# Altium project CABINET_IOT-V1.PrjPcb (part 1 of 2)
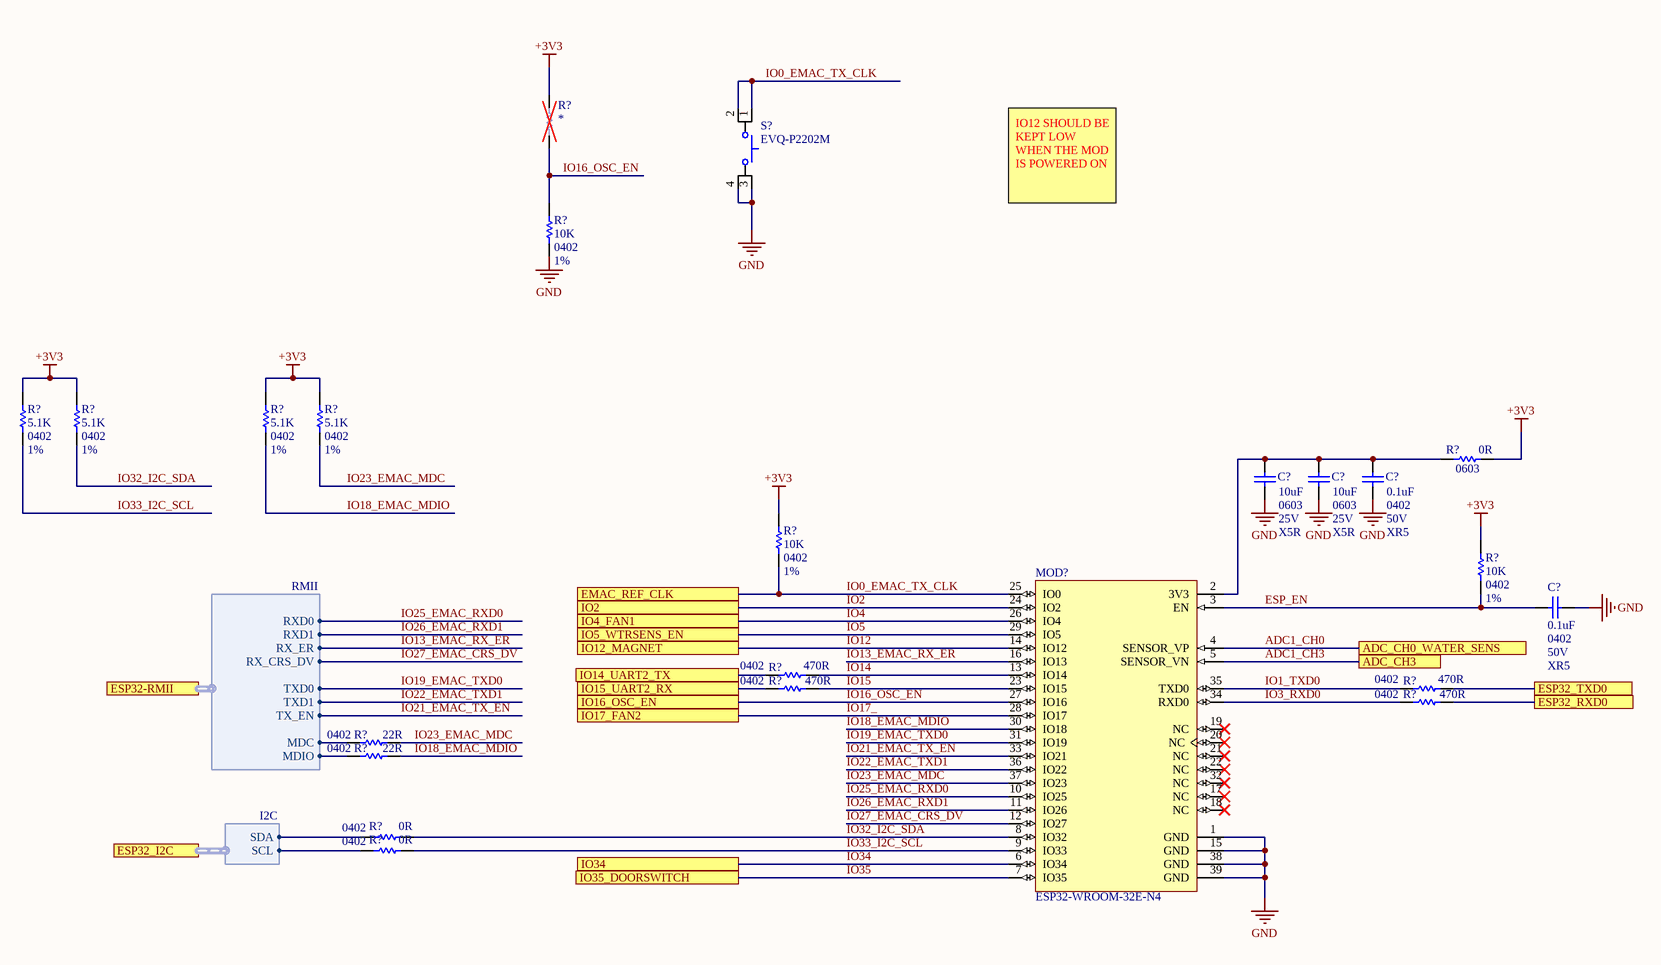
[diagram p0: 000_MCU - ESP32.SchDoc]
GlobalDrawnBy: J-E.Pachon-J.Jaramillo; GlobalReleaseDate: 202610xx; GlobalRevision: 1; GlobalVersion: 1
7 sheets, 185 parts. Net scope: flat (ports and power ports of the same name join across sheets).
Board file: Main-CABINET_IOT-V1.PcbDoc
Sheets:
  Main.SchDoc
  000_MCU - ESP32.SchDoc
  100_Power Supply.SchDoc
  200_Ethernet.SchDoc
  300_Control.SchDoc
  400_Sensors.SchDoc
  500_External.SchDoc

## Sheet Main.SchDoc: Main
size A4; Date: 202610xx; DrawnBy: J-E.Pachon-J.Jaramillo; Revision: V1R1; SheetNumber: 1; SheetTotal: 7

### Notes on the sheet
- Title:
- Project:
- File:
- Revision:
- Date:
- Size:
- A4
- Drawn by:
- www.somosinternet.com <http://www.somosinternet.com>

## Sheet 000_MCU - ESP32.SchDoc: MCU-ESP32
size A3; Date: 202610xx; DrawnBy: J-E.Pachon-J.Jaramillo; Revision: V1R1; SheetNumber: 2; SheetTotal: 7

### Parts
(Parts that share a designator on the sheet are numbered #1, #2 ... from top to bottom, then left to right.)
C?#1  10uF  PackageReference: 0603  Voltage: 25V  Temperature Coeficient: X5R  [CAPC1608X05N[0603]]
C?#2  10uF  PackageReference: 0603  Voltage: 25V  Temperature Coeficient: X5R  [CAPC1608X05N[0603]]
C?#3  0.1uF  PackageReference: 0402  Voltage: 50V  Temperature Coeficient: XR5  [CAPC1005X03N[0402]]
C?#4  0.1uF  PackageReference: 0402  Voltage: 50V  Temperature Coeficient: XR5  [CAPC1005X03N[0402]]
MOD?  ESP32-WROOM-32E-N4  [ESP32-WROOM-32D]
R?#1  *  [RESC1005X03N[0402]]
R?#2  10K  PackageReference: 0402  Tolerance: 1%  [RESC1005X03N[0402]]
R?#3  5.1K  PackageReference: 0402  Tolerance: 1%  [RESC1005X03N[0402]]
R?#4  5.1K  PackageReference: 0402  Tolerance: 1%  [RESC1005X03N[0402]]
R?#5  5.1K  PackageReference: 0402  Tolerance: 1%  [RESC1005X03N[0402]]
R?#6  5.1K  PackageReference: 0402  Tolerance: 1%  [RESC1005X03N[0402]]
R?#7  0R  PackageReference: 0603  [RESC1608X05N[0603]]
R?#8  10K  PackageReference: 0402  Tolerance: 1%  [RESC1005X03N[0402]]
R?#9  10K  PackageReference: 0402  Tolerance: 1%  [RESC1005X03N[0402]]
R?#10  470R  PackageReference: 0402  [RESC1005X03N[0402]]
R?#11  470R  PackageReference: 0402  [RESC1005X03N[0402]]
R?#12  470R  PackageReference: 0402  [RESC1005X03N[0402]]
R?#13  470R  PackageReference: 0402  [RESC1005X03N[0402]]
R?#14  22R  PackageReference: 0402  [RESC1005X03N[0402]]
R?#15  22R  PackageReference: 0402  [RESC1005X03N[0402]]
R?#16  0R  PackageReference: 0402  [RESC1005X03N[0402]]
R?#17  0R  PackageReference: 0402  [RESC1005X03N[0402]]
S?  EVQ-P2202M  [BTN470X350X210-4N]

### Ports
ADC_CH0_WATER_SENS, ADC_CH3, EMAC_REF_CLK, ESP32-RMII (harness RMII), ESP32_I2C (harness I2C), ESP32_RXD0, ESP32_TXD0, IO2, IO4_FAN1, IO5_WTRSENS_EN, IO12_MAGNET, IO14_UART2_TX, IO15_UART2_RX, IO16_OSC_EN, IO17_FAN2, IO34, IO35_DOORSWITCH

### Harnesses
RMII: TXD0, TXD1, TX_EN, MDC, MDIO, RXD0, RXD1, RX_ER, RX_CRS_DV
I2C: SDA, SCL

### Nets
+3V3: R?#1.2 R?#3.1 R?#4.1 R?#5.1 R?#6.1 R?#7.2 R?#8.2 R?#9.2  [project net MDIO_LAN]
GND: C?#1.1 C?#2.1 C?#3.1 C?#4.2 MOD?.1(GND) MOD?.15(GND) MOD?.38(GND) MOD?.39(GND) R?#2.1 S?.3 S?.4  [project net +12V]
ADC1_CH0: MOD?.4(SENSOR_VP) ; port ADC_CH0_WATER_SENS
ADC1_CH3: MOD?.5(SENSOR_VN) ; port ADC_CH3
ESP_EN: C?#4.1 MOD?.3(EN) R?#9.1
IO0_EMAC_TX_CLK: MOD?.25(IO0) R?#8.1 S?.1 S?.2 ; port EMAC_REF_CLK  [project net EMAC_REF_CLK]
IO1_TXD0: MOD?.35(TXD0) R?#12.2
IO2: MOD?.24(IO2) ; port IO2
IO3_RXD0: MOD?.34(RXD0) R?#13.2
IO4: MOD?.26(IO4) ; port IO4_FAN1  [project net FAN_CTRL1]
IO5: MOD?.29(IO5) ; port IO5_WTRSENS_EN
IO12: MOD?.14(IO12) ; port IO12_MAGNET  [project net FAN_CTRL3]
IO13_EMAC_RX_ER: MOD?.16(IO13) ; port ESP32-RMII.RX_ER
IO14: MOD?.13(IO14) R?#10.1
IO15: MOD?.23(IO15) R?#11.1
IO16_OSC_EN: MOD?.27(IO16) R?#1.1 R?#2.2 ; port IO16_OSC_EN
IO17_: MOD?.28(IO17) ; port IO17_FAN2  [project net FAN_CTRL2]
IO18_EMAC_MDIO: MOD?.30(IO18) R?#5.2 R?#15.2
IO19_EMAC_TXD0: MOD?.31(IO19) ; port ESP32-RMII.TXD0
IO21_EMAC_TX_EN: MOD?.33(IO21) ; port ESP32-RMII.TX_EN
IO22_EMAC_TXD1: MOD?.36(IO22) ; port ESP32-RMII.TXD1
IO23_EMAC_MDC: MOD?.37(IO23) R?#6.2 R?#14.2
IO25_EMAC_RXD0: MOD?.10(IO25) ; port ESP32-RMII.RXD0
IO26_EMAC_RXD1: MOD?.11(IO26) ; port ESP32-RMII.RXD1
IO27_EMAC_CRS_DV: MOD?.12(IO27) ; port ESP32-RMII.RX_CRS_DV
IO32_I2C_SDA: MOD?.8(IO32) R?#4.2 R?#16.1
IO33_I2C_SCL: MOD?.9(IO33) R?#3.2 R?#17.1
IO34: MOD?.6(IO34) ; port IO34
IO35: MOD?.7(IO35) ; port IO35_DOORSWITCH
NetC?#1_2: C?#1.2 C?#2.2 C?#3.2 MOD?.2(3V3) R?#7.1
NetR?#10_2: R?#10.2 ; port IO14_UART2_TX
NetR?#11_2: R?#11.2 ; port IO15_UART2_RX
NetR?#12_1: R?#12.1 ; port ESP32_TXD0
NetR?#13_1: R?#13.1 ; port ESP32_RXD0
NetR?#14_1: R?#14.1 ; port ESP32-RMII.MDC
NetR?#15_1: R?#15.1 ; port ESP32-RMII.MDIO
NetR?#16_2: R?#16.2 ; port ESP32_I2C.SDA
NetR?#17_2: R?#17.2 ; port ESP32_I2C.SCL

Not connected (* = marked no-connect by the designer): MOD? 17(NC)* 18(NC)* 19(NC)* 20(NC)* 21(NC)* 22(NC)* 32(NC)*

### Notes on the sheet
- IO12 SHOULD BE KEPT LOW WHEN THE MOD IS POWERED ON
- Title:
- Project:
- File:
- Revision:
- Date:
- Size:
- A3
- Drawn by:
- www.somosinternet.com <http://www.somosinternet.com>

### Library data of the parts
C?#1-C?#4 = CAP-generic: Chip Ceramic Capacitor SMD; Populated: Yes; Manuf1: *; Manuf2: *; Manuf1Partnumber: *; Manuf2Partnumber: *; ClassName: *; ROHS: Yes; LifeCycle: Checked; HelpURL: *
  C?#1 C?#2: Value: 10uF; Supplier 1: DigiKey; Supplier Part Number 1: 1276-1869-1-ND
  C?#3 C?#4: Value: 0.1uF; LCSC: C2888326; ComponentLink1Description: LCSC Link; ComponentLink1URL: https://www.lcsc.com/product-detail/C2888326.html?s_z=n_q_t_0.1uF%25200402&spm=wm.fly.bg.1.xh___wm.ssy.tc.0.tz&lcsc_vid=EgJfAwZfQFAKX11URFdeUQJWEVdaBVZUTgRWV10EQ1MxVlNeRFBaUFRXTlVaVDsOAxUeFF5JWBYZEEoKFBINSQcJGk4NBhADEA4cHktXRlVcSQwSGg0%3D
MOD? = ESP32-WROOM-32E-N4: RF TXRX MOD BT WIFI TH SMD; Manufacturer: Espressif Systems; Manufacturer Part Number: ESP32-WROOM-32E-N4; ComponentLink1URL: https://www.lcsc.com/product-detail/C701341.html?s_z=n_q_%2509%2520ESP32-WROOM-32E; ComponentLink1Description: LCSC; Supplier Part Number: C701341; Supplier: LCSC
R?#1 = DNP-RES: (DNP) "Do Not Populate" Chip Resistor SMD; Populated: No; Value: *; Manuf1: *; Manuf2: *; Manuf1Partnumber: *; Manuf2Partnumber: *; ClassName: *; ROHS: Yes; LifeCycle: Checked; HelpURL: *; Power: *; Tolerance: *
R?#2-R?#9 R?#14 R?#15 = RES-generic: Chip Resistor SMD; Populated: Yes; Manuf1: *; Manuf2: *; Manuf1Partnumber: *; Manuf2Partnumber: *; ClassName: *; ROHS: Yes; LifeCycle: Checked; HelpURL: *; Power: *
  R?#2 R?#8 R?#9: Value: 10K; Supplier 1: DigiKey; Supplier Part Number 1: 311-0.0JRCT-ND; ComponentLink1Description: LCSC Link; ComponentLink1URL: https://www.lcsc.com/product-detail/C2906861.html?s_z=n_q_t_10k%25200402&spm=wm.fly.bg.1.xh___wm.ssy.tc.0.tz&lcsc_vid=E1leBAAAQVAIUVNVR1hWXgVSR1lYV11SQQNbUFxTQQcxVlNeRFVZUVRUQ1NfVTsOAxUeFF5JWBYZEEoKFBINSQcJGk4NBhADEA4cHktXRlVeSQwSGg0%3D; LCSC: C2906861
  R?#3-R?#6: Value: 5.1K; Supplier 1: DigiKey; Supplier Part Number 1: 311-5.10KLRCT-ND
  R?#7: Value: 0R; Tolerance: *; Supplier 1: Digi-Key; Supplier Part Number 1: RMCF0603ZT0R00CT-ND
  R?#14 R?#15: Value: 22R; Tolerance: *; Supplier 1: Digi-Key; Supplier Part Number 1: 311-22.0LRCT-ND
R?#10-R?#13 R?#16 R?#17 = RES-generic: Chip Resistor SMD; Populated: Yes; Tolerance: 1%; Manuf1: *; Manuf2: *; Manuf1Partnumber: *; Manuf2Partnumber: *; ClassName: *; ROHS: Yes; LifeCycle: Checked; HelpURL: *; Power: *; Supplier 1: DigiKey
  R?#10-R?#13: Value: 470R; Supplier Part Number 1: 13-RC0402FR-13470RLCT-ND
  R?#16 R?#17: Value: 0R; Supplier Part Number 1: 311-0.0JRCT-ND
S? = BTN-4N: SPST- NO Momentary Button, 160g Force; Part Number: BTN00002; Manufacturer: Panasonic; Manufacturer Part Number: EVQ-P2202M; Supplier 1: Digi-Key; Supplier Part Number 1: P12298SCT-ND; Supplier Price 1: 0.45619; ComponentLink1URL: http://industrial.panasonic.com/www-data/pdf/ATK0000/ATK0000CE6.pdf; Value: EVQ-P2202M

## Sheet 100_Power Supply.SchDoc: Power
size A4; Date: 202610xx; DrawnBy: J-E.Pachon-J.Jaramillo; Revision: V1R1; SheetNumber: 3; SheetTotal: 7
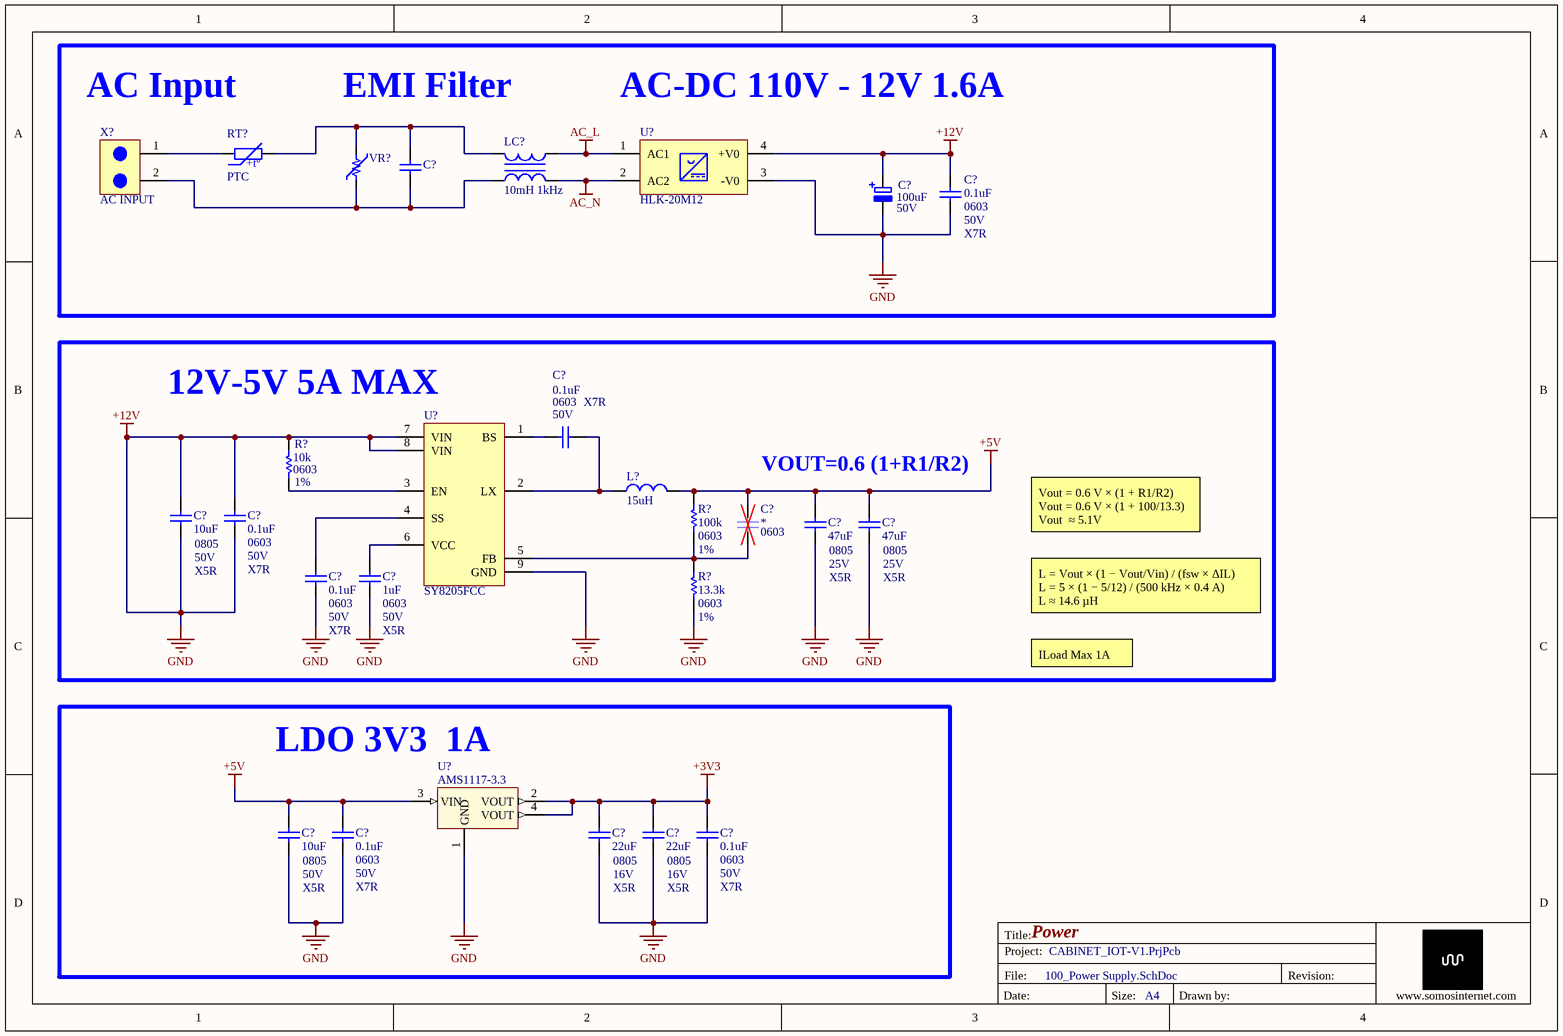
[diagram p1: 100_Power Supply.SchDoc]

### Parts
(Parts that share a designator on the sheet are numbered #1, #2 ... from top to bottom, then left to right.)
C?#5  C42Q322448P40001  [Safety Capacitor TH,P=10mm]  (value not drawn)
C?#6  0.1uF  PackageReference: 0603  Voltage: 50V  Temperature Coeficient: X7R  [CAPC1608X05N[0603]]
C?#7  100uF  Voltage: 50V  [CAP ALUM 8.3MM]
C?#8  0.1uF  PackageReference: 0603  Voltage: 50V  Temperature Coeficient: X7R  [CAPC1608X05N[0603]]
C?#9  0.1uF  PackageReference: 0603  Voltage: 50V  Temperature Coeficient: X7R  [CAPC1608X05N[0603]]
C?#10  *  PackageReference: 0603  [CAPC1608X05N[0603]]
C?#11  10uF  PackageReference: 0805  Voltage: 50V  Temperature Coeficient: X5R  [CAPC2012X05N[0805]]
C?#12  47uF  PackageReference: 0805  Voltage: 25V  Temperature Coeficient: X5R  [CAPC2012X05N[0805]]
C?#13  47uF  PackageReference: 0805  Voltage: 25V  Temperature Coeficient: X5R  [CAPC2012X05N[0805]]
C?#14  0.1uF  PackageReference: 0603  Voltage: 50V  Temperature Coeficient: X7R  [CAPC1608X05N[0603]]
C?#15  1uF  PackageReference: 0603  Voltage: 50V  Temperature Coeficient: X5R  [CAPC1608X05N[0603]]
C?#16  0.1uF  PackageReference: 0603  Voltage: 50V  Temperature Coeficient: X7R  [CAPC1608X05N[0603]]
C?#17  0.1uF  PackageReference: 0603  Voltage: 50V  Temperature Coeficient: X7R  [CAPC1608X05N[0603]]
C?#18  10uF  PackageReference: 0805  Voltage: 50V  Temperature Coeficient: X5R  [CAPC2012X05N[0805]]
C?#19  22uF  PackageReference: 0805  Voltage: 16V  Temperature Coeficient: X5R  [CAPC2012X05N[0805]]
C?#20  22uF  PackageReference: 0805  Voltage: 16V  Temperature Coeficient: X5R  [CAPC2012X05N[0805]]
L?#1  15uH  [SRN5020TA]
LC?  value 10mH 1kHz  [LC_10mH_1kHz_0.7A]  (hidden comment: PDUUAT98-103MLN)
R?#18  10k  PackageReference: 0603  Tolerance: 1%  [RESC1608X05N[0603]]
R?#19  100k  PackageReference: 0603  Tolerance: 1%  [RESC1608X05N[0603]]
R?#20  13.3k  PackageReference: 0603  Tolerance: 1%  [RESC1608X05N[0603]]
RT?  PTC  [POLYSW200-5638-310]
U?#1  HLK-20M12  [DIP,56x32mm]
U?#2  SY8205FCC  [SOIC127P600X160_HS-9N]
U?#3  AMS1117-3.3  [4-SOT_223]
VR?  175VAC 2.5kA  [Varistor FTR10D271K]  (value not drawn)
X?#1  AC INPUT  [TH,Right Angle,P=5mm]

### Blocks framed on the sheet
12V-5V 5A MAX: C?#8-C?#15 L?#1 R?#18-R?#20 U?#2
LDO 3V3  1A: C?#16-C?#20 U?#3

### Nets
+3V3: C?#17.1 C?#19.2 C?#20.2 U?#3.2(VOUT) U?#3.4(VOUT)  [project net MDIO_LAN]
+5V: C?#10.2 C?#12.2 C?#13.2 C?#16.1 C?#18.2 L?#1.2 R?#19.2 U?#3.3(VIN)
+12V: C?#6.1 C?#6.2 C?#7.+ C?#7.- C?#9.1 C?#9.2 C?#11.1 C?#11.2 C?#12.1 C?#13.1 C?#14.2 C?#15.1 C?#16.2 C?#17.2 C?#18.1 C?#19.1 C?#20.1 R?#18.2 R?#20.1 U?#1.3(-V0) U?#1.4(+V0) U?#2.7(VIN) U?#2.8(VIN) U?#2.9(GND) U?#3.1(GND)  [also labelled GND]
AC_L: LC?.4 U?#1.1(AC1)
AC_N: LC?.3 U?#1.2(AC2)
NetC?#5_1: C?#5.1 LC?.2 VR?.1 X?#1.2
NetC?#5_2: C?#5.2 LC?.1 RT?.2 VR?.2
NetC?#8_1: C?#8.1 L?#1.1 U?#2.2(LX)
NetC?#8_2: C?#8.2 U?#2.1(BS)
NetC?#10_1: C?#10.1 R?#19.1 R?#20.2 U?#2.5(FB)
NetC?#14_1: C?#14.1 U?#2.4(SS)
NetC?#15_2: C?#15.2 U?#2.6(VCC)
NetR?#18_1: R?#18.1 U?#2.3(EN)
NetRT?_1: RT?.1 X?#1.1

### Notes on the sheet
- AC Input
- EMI Filter
- (near U?#1) AC-DC 110V - 12V 1.6A
- (near C?#13) VOUT=0.6 (1+R1/R2)
- Vout = 0.6 V × (1 + R1/R2)
  Vout = 0.6 V × (1 + 100/13.3)
  Vout  ≈ 5.1V
- L = Vout × (1 − Vout/Vin) / (fsw × ΔIL)
  L = 5 × (1 − 5/12) / (500 kHz × 0.4 A)
  L ≈ 14.6 µH
- ILoad Max 1A
- Title:
- Project:
- File:
- Revision:
- Date:
- Size:
- A4
- Drawn by:
- www.somosinternet.com <http://www.somosinternet.com>
- (in symbol PTC) +tº

### Library data of the parts
C?#5 = Safety Capacitor C42Q322448P40001: CAP SAFETY 220nF ±10% 275V 310V TH; Manufacturer: WALSON; Manufacturer Part Number: C42Q322448P40001; Supplier 1: LCSC; Supplier Part Number 1: C46638866; ComponentLink1Description: LCSC; ComponentLink1URL: https://www.lcsc.com/product-detail/C46638866.html
C?#6 C?#8 C?#9 C?#14-C?#17 = CAP-generic: as C?#1 on sheet 000_MCU - ESP32; Manuf1: *; Manuf2: *; Manuf1Partnumber: *; Manuf2Partnumber: *; ClassName: *; ROHS: Yes; LifeCycle: Checked; HelpURL: *
  C?#6 C?#8 C?#9 C?#14 C?#16 C?#17: Value: 0.1uF; LCSC: C113803
  C?#15: Value: 1uF; Supplier 1: DigiKey; Supplier Part Number 1: 490-GRM155R61H105ME05DDKR-ND; LCSC: C128624
C?#7 = CAPPOL-generic: Polarized Capacitor SMD; Manufacturer: JIERR; Manufacturer Part Number: RV50V100M8X10; Populated: Yes; Value: 100uF; ClassName: *; ROHS: Yes; LifeCycle: Checked; HelpURL: *; Supplier 1: Digikey; Supplier Part Number 1: 493-9631-1-ND; LCSC: C48935390
C?#10 = DNP-CAP: (DNP) "Do Not Populate" Chip Ceramic Capacitor SMD; Populated: No; Value: *; Manuf1: *; Manuf2: *; Manuf1Partnumber: *; Manuf2Partnumber: *; ClassName: *; ROHS: Yes; LifeCycle: Checked; HelpURL: *; Voltage: *
C?#11 C?#18 = CAP-generic: Chip Ceramic Capacitor SMD; Manuf1: muRata; Manuf1Partnumber: GRM21BR61H106KE43L; Populated: Yes; Value: 10uF; Manuf2: *; Manuf2Partnumber: *; ClassName: *; ROHS: Yes; LifeCycle: Checked; HelpURL: *; LCSC: C440198
C?#12 C?#13 = CAP-generic: Chip Ceramic Capacitor SMD; Manuf1: Samsung Electro-Mechanics; Manuf1Partnumber: CL21A476MQYNNNE; Populated: Yes; Value: 47uF; Manuf2: *; Manuf2Partnumber: *; ClassName: *; ROHS: Yes; LifeCycle: Checked; HelpURL: *; LCSC: C16780
C?#19 C?#20 = CAP-generic: Chip Ceramic Capacitor SMD; Manuf1: Samsung Electro-Mechanics; Manuf1Partnumber: CL21A226MOQNNNE; Populated: Yes; Value: 22uF; Manuf2: *; Manuf2Partnumber: *; ClassName: *; ROHS: Yes; LifeCycle: Checked; HelpURL: *; LCSC: C98190
L?#1 = SRN5020TA-120M: FIXED IND 12UH 1.4A 135 MOHM SMD; Manufacturer 1: cjiang; Manufacturer Part Number 1: FNR5020S150MT; Supplier 1: LCSC; ComponentLink1URL: https://www.lcsc.com/product-detail/C167939.html; ComponentLink1Description: LCSC; Supplier Part Number 1: C167939; Value: 15uH
LC? = LC_10mH_1kHz_0.7A: CMC 1.5A 2LN 1.4KOHM SMD; Manufacturer: PROD Tech; Manufacturer Part Number: PDUUAT98-103MLN; ComponentLink1Description: Digi-Key; ComponentLink1URL: https://www.digikey.com/en/products/detail/murata-electronics/DLW5BTH142TQ2L/7564115; Supplier 1: LCSC; Supplier Part Number 1: C2909797
R?#18 = RES-generic: Chip Resistor SMD; Populated: Yes; Value: 10k; Manuf1: *; Manuf2: *; Manuf1Partnumber: *; Manuf2Partnumber: *; ClassName: *; ROHS: Yes; LifeCycle: Checked; HelpURL: *; Power: *; Supplier 1: Digikey; Supplier Part Number 1: 1276-3431-1-ND; LCSC: C5139509
R?#19 = RES-generic: Chip Resistor SMD; Manuf1: YAGEO; Manuf1Partnumber: RC0603FR-07100KL; Populated: Yes; Value: 100k; Manuf2: *; Manuf2Partnumber: *; ClassName: *; ROHS: Yes; LifeCycle: Checked; HelpURL: *; Power: *; LCSC: C14675; ComponentLink1Description: LCSC; ComponentLink1URL: https://www.lcsc.com/product-detail/C14675.html?s_z=n_q_t_resistors
R?#20 = RES-generic: Chip Resistor SMD; Manuf1: FOJAN; Manuf1Partnumber: FRC0603F1332TS; Populated: Yes; Value: 13.3k; Manuf2: *; Manuf2Partnumber: *; ClassName: *; ROHS: Yes; LifeCycle: Checked; HelpURL: *; Power: *; LCSC: C2933140; ComponentLink1Description: LCSC; ComponentLink1URL: https://www.lcsc.com/product-detail/C2933140.html?s_z=n_q_t_resistors
RT? = PTC: PTC RESET FUSE 250V 145mA TH; Manufacturer: Jinrui; Manufacturer Part Number: JK250-145U; Supplier 1: LCSC; Supplier Part Number 1: C369131; ComponentLink1Description: LCSC; ComponentLink1URL: https://www.lcsc.com/product-detail/C369131.html
U?#1 = HLK-20M12: 20W Series of Ultra-compact Power Module; Manufacturer: HI-LINK; Manufacturer Part Number: HLK-20M12; Supplier: LCSC; Supplier Part Number: C465408; ComponentLink1Description: LCSC; ComponentLink1URL: https://www.lcsc.com/product-detail/C465408.html?s_z=n_q_HI-LINK%2520HLK-20M12
U?#2 = SY8205FCC: High Efficiency Fast Response, 5A, 30V Input Synchronous Step Down Regulator; Manufacturer: Silergy; Manufacturer Part Number: SY8205FCC; LCSC: C111875; ComponentLink1Description: LCSC Link; ComponentLink1URL: https://www.lcsc.com/product-detail/C111875.html?spm=wm.fly.bg.1.xh___wm.fly.tp.26.ml&lcsc_vid=RldZXlJfEVNXXwYAFFQKVFJeFlYKVlFWQlFfXl1WRQMxVlNeRldbU1NfQllZUzsOAxUeFF5JWBYZEEoKFBINSQcJGk4NBhADEA4cHktXR1NXSQwSGg0%3D
U?#3 = AMS1117-3.3: 1A LDO Voltage Regulator; Manufacturer: UMW; Manufacturer Part Number: AMS1117-3.3; Supplier 1: LCSC; Supplier Part Number 1: C347222; ComponentLink1Description: LCSC; ComponentLink1URL: https://www.lcsc.com/product-detail/C347222.html?s_z=n_q_p_Ams-117-3.3
VR? = Varistor FTR10D271K: VARISTOR 243V~297V 2.5kA P=7.5mm; Manufacturer: FTR; Manufacturer Part Number: FTR10D271K; Supplier 1: LCSC; Supplier Part Number 1: C693524; ComponentLink1Description: Digi-Key; ComponentLink1URL: https://www.lcsc.com/product-detail/C693524.html?s_z=n_q_C693524&globalKeyword=C693524
X?#1 = TERMINAL BLOCK 2PIN 5mm: TERM BLOCK HDR 2POS 5MM; Manufacturer: Cixi Kefa Elec; Manufacturer Part number: KF2EDGRC-5.0-2P; Supplier: LCSC; Supplier Part Number 1: C441225; ComponentLink1Description: LCSC; ComponentLink1URL: https://www.lcsc.com/product-detail/C441225.html

## Sheet 200_Ethernet.SchDoc: Ethernet
size A2; Date: 202610xx; DrawnBy: J-E.Pachon-J.Jaramillo; Revision: V1R1; SheetNumber: 4; SheetTotal: 7
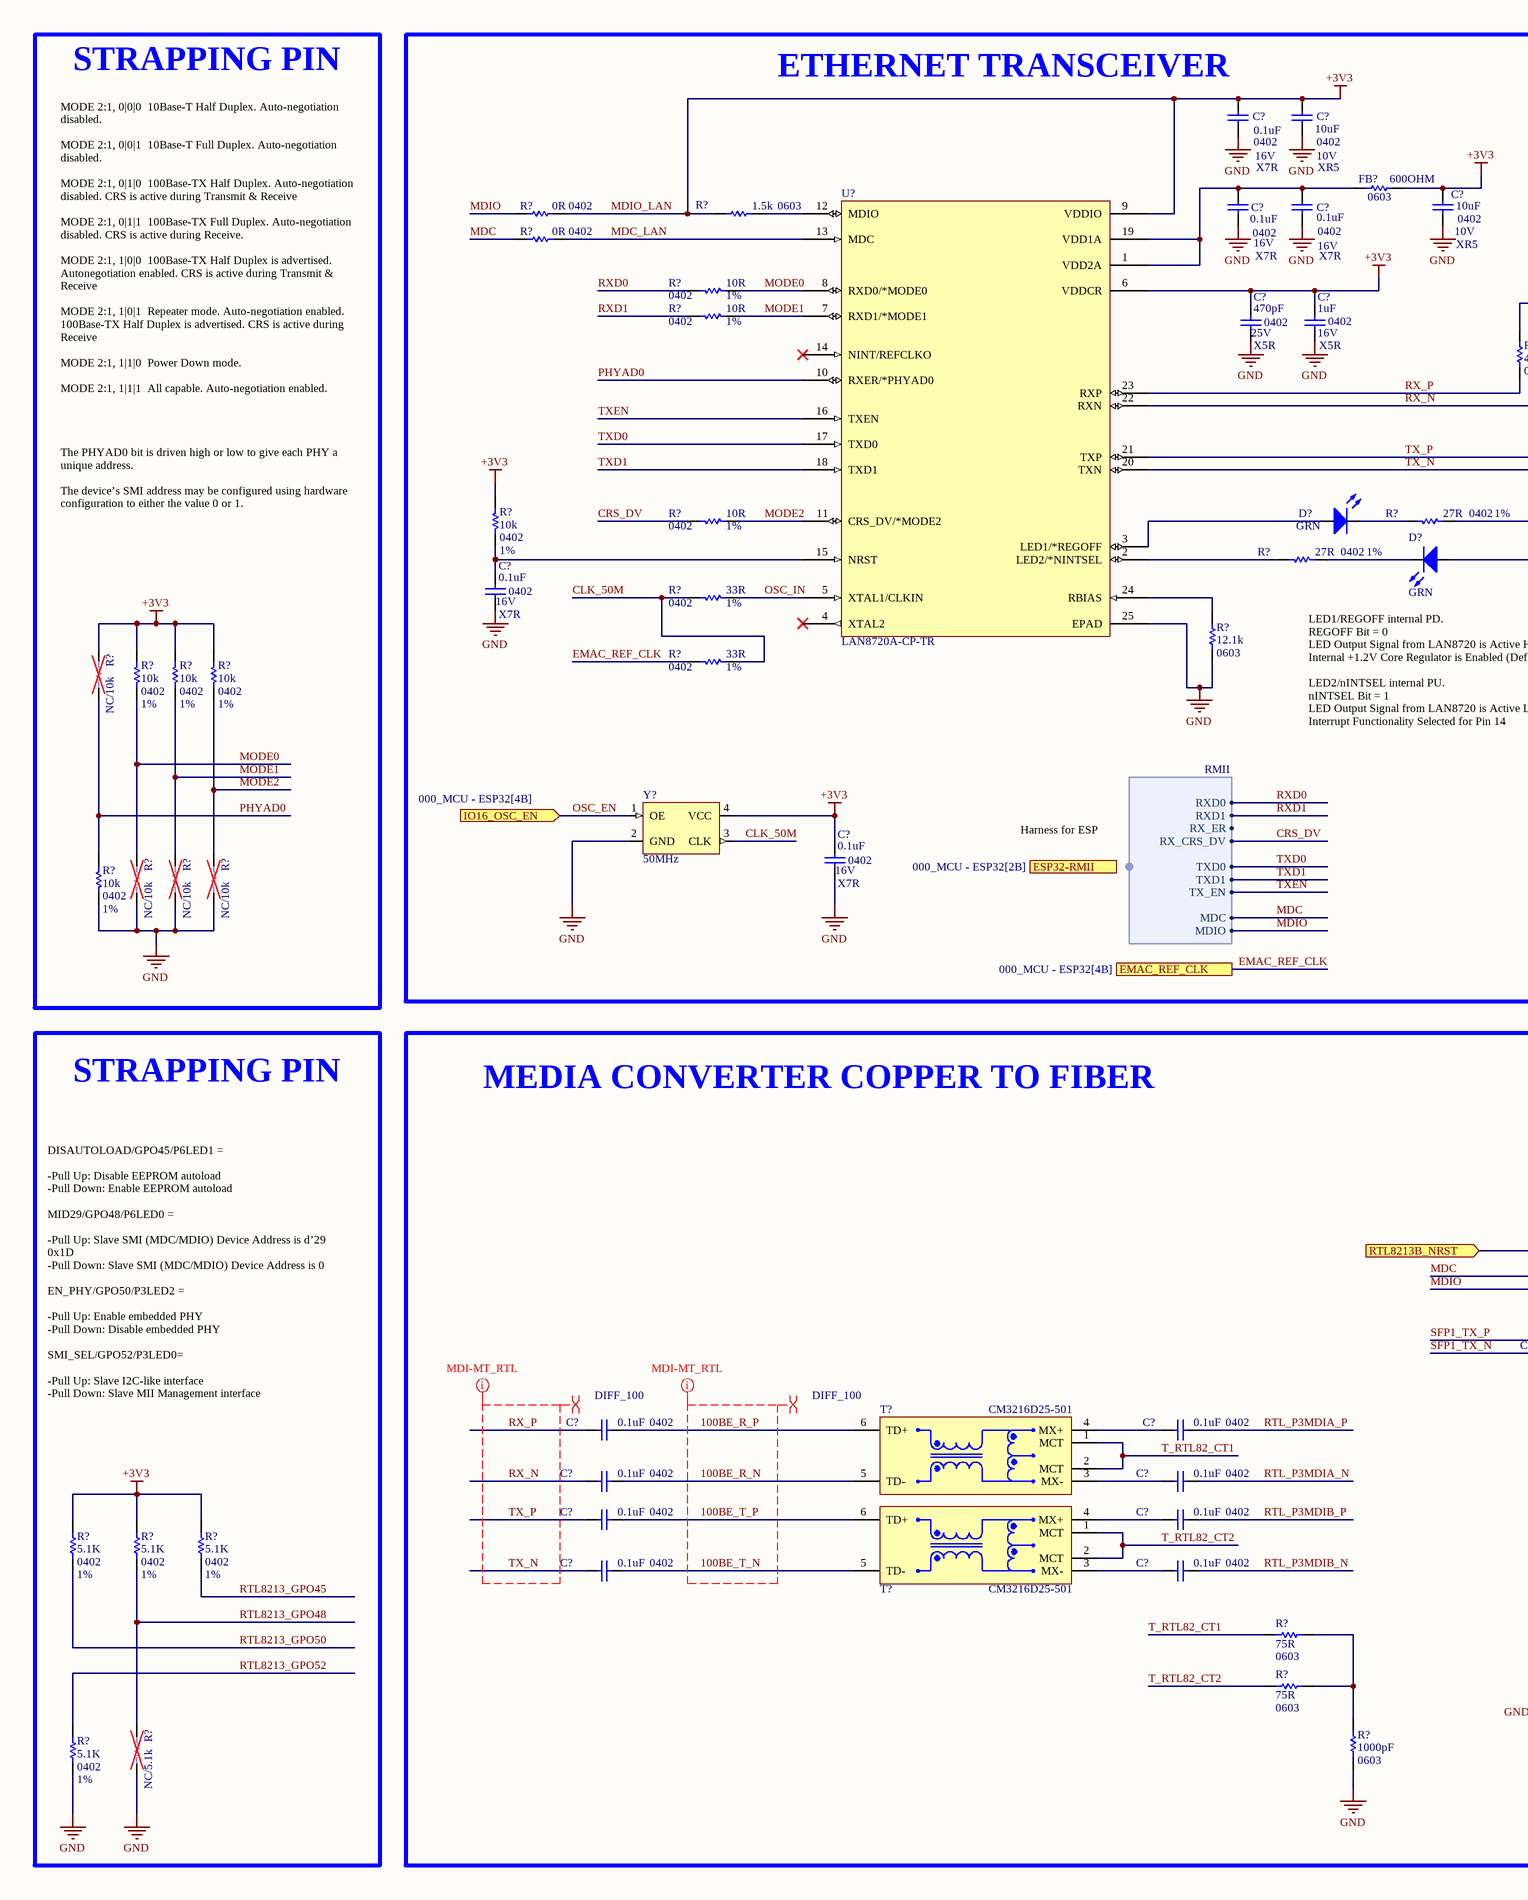
[diagram p2: 200_Ethernet.SchDoc, left]
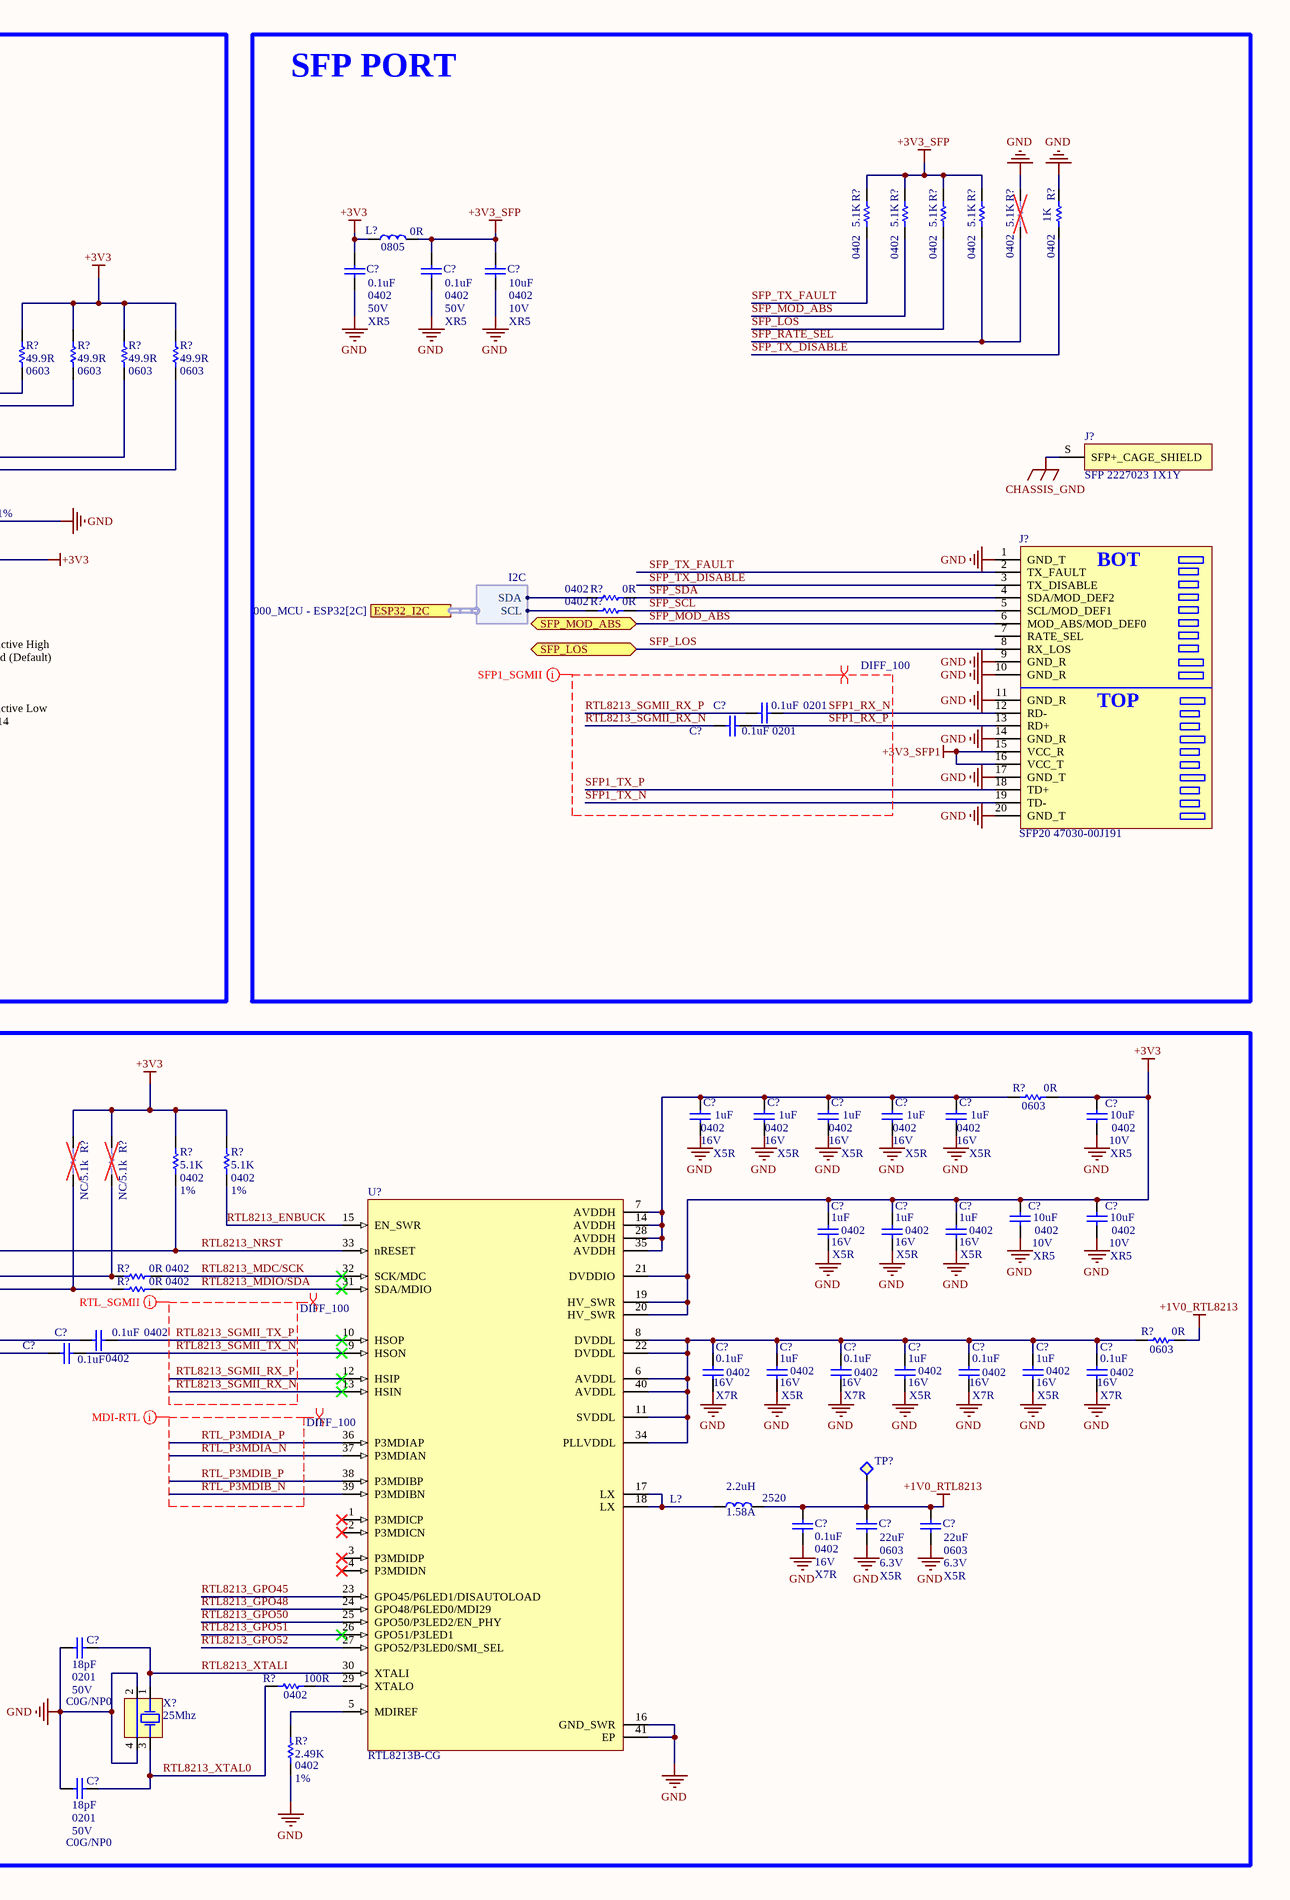
[diagram p3: 200_Ethernet.SchDoc, right]

### Parts
(Parts that share a designator on the sheet are numbered #1, #2 ... from top to bottom, then left to right.)
C?#21  0.1uF  PackageReference: 0402  Voltage: 16V  Temperature Coeficient: X7R  [CAPC1005X03N[0402]]
C?#22  10uF  PackageReference: 0402  Voltage: 10V  Temperature Coeficient: XR5  [CAPC1005X03N[0402]]
C?#23  0.1uF  PackageReference: 0402  Voltage: 16V  Temperature Coeficient: X7R  [CAPC1005X03N[0402]]
C?#24  0.1uF  PackageReference: 0402  Voltage: 16V  Temperature Coeficient: X7R  [CAPC1005X03N[0402]]
C?#25  10uF  PackageReference: 0402  Voltage: 10V  Temperature Coeficient: XR5  [CAPC1005X03N[0402]]
C?#26  0.1uF  PackageReference: 0402  Voltage: 50V  Temperature Coeficient: XR5  [CAPC1005X03N[0402]]
C?#27  0.1uF  PackageReference: 0402  Voltage: 50V  Temperature Coeficient: XR5  [CAPC1005X03N[0402]]
C?#28  10uF  PackageReference: 0402  Voltage: 10V  Temperature Coeficient: XR5  [CAPC1005X03N[0402]]
C?#29  470pF  PackageReference: 0402  Voltage: 25V  Temperature Coeficient: X5R  [CAPC1005X03N[0402]]
C?#30  1uF  PackageReference: 0402  Voltage: 16V  Temperature Coeficient: X5R  [CAPC1005X03N[0402]]
C?#31  0.1uF  PackageReference: 0402  Voltage: 16V  Temperature Coeficient: X7R  [CAPC1005X03N[0402]]
C?#32  0.1uF  PackageReference: 0201  [CAPC0603X04N[0201]]
C?#33  0.1uF  PackageReference: 0201  [CAPC0603X04N[0201]]
C?#34  0.1uF  PackageReference: 0402  Voltage: 16V  Temperature Coeficient: X7R  [CAPC1005X03N[0402]]
C?#35  1uF  PackageReference: 0402  Voltage: 16V  Temperature Coeficient: X5R  [CAPC1005X03N[0402]]
C?#36  1uF  PackageReference: 0402  Voltage: 16V  Temperature Coeficient: X5R  [CAPC1005X03N[0402]]
C?#37  1uF  PackageReference: 0402  Voltage: 16V  Temperature Coeficient: X5R  [CAPC1005X03N[0402]]
C?#38  1uF  PackageReference: 0402  Voltage: 16V  Temperature Coeficient: X5R  [CAPC1005X03N[0402]]
C?#39  1uF  PackageReference: 0402  Voltage: 16V  Temperature Coeficient: X5R  [CAPC1005X03N[0402]]
C?#40  10uF  PackageReference: 0402  Voltage: 10V  Temperature Coeficient: XR5  [CAPC1005X03N[0402]]
C?#41  10uF  PackageReference: 0402  Voltage: 10V  Temperature Coeficient: XR5  [CAPC1005X03N[0402]]
C?#42  10uF  PackageReference: 0402  Voltage: 10V  Temperature Coeficient: XR5  [CAPC1005X03N[0402]]
C?#43  1uF  PackageReference: 0402  Voltage: 16V  Temperature Coeficient: X5R  [CAPC1005X03N[0402]]
C?#44  1uF  PackageReference: 0402  Voltage: 16V  Temperature Coeficient: X5R  [CAPC1005X03N[0402]]
C?#45  1uF  PackageReference: 0402  Voltage: 16V  Temperature Coeficient: X5R  [CAPC1005X03N[0402]]
C?#46  0.1uF  PackageReference: 0402  [CAPC1005X03N[0402]]
C?#47  0.1uF  PackageReference: 0402  [CAPC1005X03N[0402]]
C?#48  0.1uF  PackageReference: 0402  Voltage: 16V  Temperature Coeficient: X7R  [CAPC1005X03N[0402]]
C?#49  1uF  PackageReference: 0402  Voltage: 16V  Temperature Coeficient: X5R  [CAPC1005X03N[0402]]
C?#50  0.1uF  PackageReference: 0402  Voltage: 16V  Temperature Coeficient: X7R  [CAPC1005X03N[0402]]
C?#51  1uF  PackageReference: 0402  Voltage: 16V  Temperature Coeficient: X5R  [CAPC1005X03N[0402]]
C?#52  0.1uF  PackageReference: 0402  Voltage: 16V  Temperature Coeficient: X7R  [CAPC1005X03N[0402]]
C?#53  1uF  PackageReference: 0402  Voltage: 16V  Temperature Coeficient: X5R  [CAPC1005X03N[0402]]
C?#54  0.1uF  PackageReference: 0402  Voltage: 16V  Temperature Coeficient: X7R  [CAPC1005X03N[0402]]
C?#55  0.1uF  PackageReference: 0402  [CAPC1005X03N[0402]]
C?#56  0.1uF  PackageReference: 0402  [CAPC1005X03N[0402]]
C?#57  0.1uF  PackageReference: 0402  [CAPC1005X03N[0402]]
C?#58  0.1uF  PackageReference: 0402  [CAPC1005X03N[0402]]
C?#59  0.1uF  PackageReference: 0402  [CAPC1005X03N[0402]]
C?#60  0.1uF  PackageReference: 0402  [CAPC1005X03N[0402]]
C?#61  0.1uF  PackageReference: 0402  Voltage: 16V  Temperature Coeficient: X7R  [CAPC1005X03N[0402]]
C?#62  22uF  PackageReference: 0603  Voltage: 6.3V  Temperature Coeficient: X5R  [CAPC1608X05N[0603]]
C?#63  22uF  PackageReference: 0603  Voltage: 6.3V  Temperature Coeficient: X5R  [CAPC1608X05N[0603]]
C?#64  0.1uF  PackageReference: 0402  [CAPC1005X03N[0402]]
C?#65  0.1uF  PackageReference: 0402  [CAPC1005X03N[0402]]
C?#66  18pF  PackageReference: 0201  Voltage: 50V  Temperature Coefficient: C0G/NP0  [CAPC0603X04N[0201]]
C?#67  18pF  PackageReference: 0201  Voltage: 50V  Temperature Coefficient: C0G/NP0  [CAPC0603X04N[0201]]
D?#1  GRN  [LED1608L(0603)]
D?#2  GRN  [LED1608L(0603)]
FB?  600OHM  PackageReference: 0603  [RESC1608X05N[0603]]
J?#1  SFP 2227023 1X1Y  [AMPHENOL_U77A16182001]
J?#2  SFP20 47030-00J191  [AMPHENOL_UE76A202000T]
L?#2  0R  PackageReference: 0805  [INDC2012X05N[0805]]
L?#3  2.2uH  PackageReference: 2520  Current: 1.58A  [INDP2520X10N[2510]-TDK]
R?#21  0R  PackageReference: 0402  [RESC1005X03N[0402]]
R?#22  1.5k  PackageReference: 0603  [RESC1608X05N[0603]]
R?#23  5.1K  PackageReference: 0402  [RESC1005X03N[0402]]
R?#24  5.1K  PackageReference: 0402  [RESC1005X03N[0402]]
R?#25  5.1K  PackageReference: 0402  [RESC1005X03N[0402]]
R?#26  5.1K  PackageReference: 0402  [RESC1005X03N[0402]]
R?#27  5.1K  PackageReference: 0402  [RESC1005X03N[0402]]
R?#28  1K  PackageReference: 0402  [RESC1005X03N[0402]]
R?#29  0R  PackageReference: 0402  [RESC1005X03N[0402]]
R?#30  10R  PackageReference: 0402  Tolerance: 1%  [RESC1005X03N[0402]]
R?#31  10R  PackageReference: 0402  Tolerance: 1%  [RESC1005X03N[0402]]
R?#32  49.9R  PackageReference: 0603  [RESC1608X05N[0603]]
R?#33  49.9R  PackageReference: 0603  [RESC1608X05N[0603]]
R?#34  49.9R  PackageReference: 0603  [RESC1608X05N[0603]]
R?#35  49.9R  PackageReference: 0603  [RESC1608X05N[0603]]
R?#36  10k  PackageReference: 0402  Tolerance: 1%  [RESC1005X03N[0402]]
R?#37  10R  PackageReference: 0402  Tolerance: 1%  [RESC1005X03N[0402]]
R?#38  27R  PackageReference: 0402  Tolerance: 1%  [RESC1005X03N[0402]]
R?#39  27R  PackageReference: 0402  Tolerance: 1%  [RESC1005X03N[0402]]
R?#40  33R  PackageReference: 0402  Tolerance: 1%  [RESC1005X03N[0402]]
R?#41  0R  PackageReference: 0402  [RESC1005X03N[0402]]
R?#42  0R  PackageReference: 0402  [RESC1005X03N[0402]]
R?#43  12.1k  PackageReference: 0603  [RESC1608X05N[0603]]
R?#44  33R  PackageReference: 0402  Tolerance: 1%  [RESC1005X03N[0402]]
R?#45  NC/10k  [RESC1005X03N[0402]]
R?#46  10k  PackageReference: 0402  Tolerance: 1%  [RESC1005X03N[0402]]
R?#47  10k  PackageReference: 0402  Tolerance: 1%  [RESC1005X03N[0402]]
R?#48  10k  PackageReference: 0402  Tolerance: 1%  [RESC1005X03N[0402]]
R?#49  10k  PackageReference: 0402  Tolerance: 1%  [RESC1005X03N[0402]]
R?#50  NC/10k  [RESC1005X03N[0402]]
R?#51  NC/10k  [RESC1005X03N[0402]]
R?#52  NC/10k  [RESC1005X03N[0402]]
R?#53  0R  PackageReference: 0603  [RESC1608X05N[0603]]
R?#54  NC/5.1k  [RESC1005X03N[0402]]
R?#55  NC/5.1k  [RESC1005X03N[0402]]
R?#56  5.1K  PackageReference: 0402  Tolerance: 1%  [RESC1005X03N[0402]]
R?#57  5.1K  PackageReference: 0402  Tolerance: 1%  [RESC1005X03N[0402]]
R?#58  0R  PackageReference: 0402  [RESC1005X03N[0402]]
R?#59  0R  PackageReference: 0402  [RESC1005X03N[0402]]
R?#60  0R  PackageReference: 0603  [RESC1608X05N[0603]]
R?#61  5.1K  PackageReference: 0402  Tolerance: 1%  [RESC1005X03N[0402]]
R?#62  5.1K  PackageReference: 0402  Tolerance: 1%  [RESC1005X03N[0402]]
R?#63  5.1K  PackageReference: 0402  Tolerance: 1%  [RESC1005X03N[0402]]
R?#64  75R  PackageReference: 0603  [RESC1608X05N[0603]]
R?#65  75R  PackageReference: 0603  [RESC1608X05N[0603]]
R?#66  100R  PackageReference: 0402  [RESC1005X03N[0402]]
R?#67  1000pF  PackageReference: 0603  [RESC1608X05N[0603]]
R?#68  5.1K  PackageReference: 0402  Tolerance: 1%  [RESC1005X03N[0402]]
R?#69  NC/5.1k  [RESC1005X03N[0402]]
R?#70  2.49K  PackageReference: 0402  Tolerance: 1%  [RESC1005X03N[0402]]
T?#1  CM3216D25-501  [CNDTek_CM3216D25-501]
T?#2  CM3216D25-501  [CNDTek_CM3216D25-501]
TP?  (no value)  [TestPoint-1mm]  (no BOM)
U?#4  LAN8720A-CP-TR  [QFN50P400X400X90-24D250N]
U?#5  RTL8213B-CG  [QFN40P500X500X90_HS-41N-REALTEK]
X?#2  25Mhz  [3.2X2.5MM]
Y?  50MHz  [SMD2520-4P]

### Blocks framed on the sheet
STRAPPING PIN: R?#45-R?#52
ETHERNET TRANSCEIVER: C?#21-C?#25 C?#29-C?#31 C?#34 D?#1 D?#2 FB? R?#21 R?#22 R?#29-R?#40 R?#43 R?#44 U?#4 Y?
SFP PORT: C?#26-C?#28 C?#32 C?#33 J?#1 J?#2 L?#2 R?#23-R?#28 R?#41 R?#42
STRAPPING PIN: R?#61-R?#63 R?#68 R?#69
MEDIA CONVERTER COPPER TO FIBER: C?#35-C?#67 L?#3 R?#53-R?#60 R?#64-R?#67 R?#70 T?#1 T?#2 TP? U?#5 X?#2

### Ports
EMAC_REF_CLK (see 000_MCU - ESP32[4B]), ESP32-RMII (harness RMII, see 000_MCU - ESP32[2B]), ESP32_I2C (harness I2C, see 000_MCU - ESP32[2C]), IO16_OSC_EN (in, see 000_MCU - ESP32[4B]), RTL8213B_NRST (in), SFP_LOS (bidir), SFP_MOD_ABS (bidir)

### Harnesses
RMII: TXD0, TXD1, TX_EN, MDC, MDIO, RXD0, RXD1, RX_ER, RX_CRS_DV
I2C: SDA, SCL

### Nets
+1V0_RTL8213: C?#61.2 C?#62.2 C?#63.2 L?#3.2 R?#60.2 TP?.1(TEST)
+3V3_SFP: C?#27.2 C?#28.2 L?#2.2 R?#23.1 R?#24.1 R?#25.1 R?#26.1
+3V3_SFP1: J?#2.15(VCC_R) J?#2.16(VCC_T)
CHASSIS_GND: J?#1.S(SFP+_CAGE_SHIELD)
GND: C?#21.1 C?#22.1 C?#23.1 C?#24.1 C?#25.1 C?#26.1 C?#27.1 C?#28.1 C?#29.1 C?#30.1 C?#31.1 C?#34.1 C?#35.1 C?#36.1 C?#37.1 C?#38.1 C?#39.1 C?#40.1 C?#41.1 C?#42.1 C?#43.1 C?#44.1 C?#45.1 C?#48.1 C?#49.1 C?#50.1 C?#51.1 C?#52.1 C?#53.1 C?#54.1 C?#61.1 C?#62.1 C?#63.1 C?#66.2 C?#67.2 J?#2.1(GND_T) J?#2.9(GND_R) J?#2.10(GND_R) J?#2.11(GND_R) J?#2.14(GND_R) J?#2.17(GND_T) J?#2.20(GND_T) R?#27.2 R?#28.1 R?#38.1 R?#43.1 R?#49.1 R?#50.1 R?#51.1 R?#52.1 R?#67.2 R?#68.2 R?#69.1 R?#70.1 U?#4.25(EPAD) U?#5.16(GND_SWR) U?#5.41(EP) X?#2.2(COM) X?#2.4(COM) Y?.2(GND)  [project net +12V]
MDIO_LAN: C?#21.2 C?#22.2 C?#25.2 C?#26.2 C?#29.2 C?#30.2 C?#34.2 C?#40.2 C?#41.2 C?#42.2 C?#43.2 C?#44.2 C?#45.2 D?#2.A FB?.2 L?#2.1 R?#21.1 R?#22.2 R?#32.2 R?#33.2 R?#34.2 R?#35.2 R?#36.2 R?#45.2 R?#46.2 R?#47.2 R?#48.2 R?#53.2 R?#54.2 R?#55.2 R?#56.1 R?#57.1 R?#61.1 R?#62.1 R?#63.1 U?#4.6(VDDCR) U?#4.9(VDDIO) U?#5.19(HV_SWR) U?#5.20(HV_SWR) U?#5.21(DVDDIO) Y?.4(VCC)  [also labelled +3V3]
100BE_R_N: C?#57.1 T?#1.5(TD-)
100BE_R_P: C?#55.1 T?#1.6(TD+)
100BE_T_N: C?#64.1 T?#2.5(TD-)
100BE_T_P: C?#59.1 T?#2.6(TD+)
CLK_50M: R?#40.2 R?#44.1 Y?.3(CLK)
CRS_DV: R?#37.2 ; harness RMII.RX_CRS_DV
EMAC_REF_CLK: R?#44.2 ; port EMAC_REF_CLK
MDC: R?#29.2 R?#55.1 R?#58.2 ; harness RMII.MDC
MDC_LAN: R?#29.1 U?#4.13(MDC)
MDIO: R?#21.2 R?#54.1 R?#59.2 ; harness RMII.MDIO
MODE0: R?#30.1 R?#46.1 R?#50.2 U?#4.8(RXD0/*MODE0)
MODE1: R?#31.1 R?#47.1 R?#51.2 U?#4.7(RXD1/*MODE1)
MODE2: R?#37.1 R?#48.1 R?#52.2 U?#4.11(CRS_DV/*MODE2)
OSC_EN: Y?.1(OE) ; port IO16_OSC_EN  [project net IO16_OSC_EN]
OSC_IN: R?#40.1 U?#4.5(XTAL1/CLKIN)
PHYAD0: R?#45.1 R?#49.2 U?#4.10(RXER/*PHYAD0)
RTL8213_ENBUCK: R?#57.2 U?#5.15(EN_SWR)
RTL8213_GPO45: R?#63.2 U?#5.23(GPO45/P6LED1/DISAUTOLOAD)
RTL8213_GPO48: R?#62.2 R?#69.2 U?#5.24(GPO48/P6LED0/MDI29)
RTL8213_GPO50: R?#61.2 U?#5.25(GPO50/P3LED2/EN_PHY)
RTL8213_GPO51: U?#5.26(GPO51/P3LED1)
RTL8213_GPO52: R?#68.1 U?#5.27(GPO52/P3LED0/SMI_SEL)
RTL8213_MDC/SCK: R?#58.1 U?#5.32(SCK/MDC)
RTL8213_MDIO/SDA: R?#59.1 U?#5.31(SDA/MDIO)
RTL8213_NRST: R?#56.2 U?#5.33(nRESET) ; port RTL8213B_NRST
RTL8213_SGMII_RX_N: C?#33.2 U?#5.13(HSIN)
RTL8213_SGMII_RX_P: C?#32.2 U?#5.12(HSIP)
RTL8213_SGMII_TX_N: C?#47.1 U?#5.9(HSON)
RTL8213_SGMII_TX_P: C?#46.1 U?#5.10(HSOP)
RTL8213_XTAL0: C?#67.1 R?#66.2 X?#2.3(OSC2)
RTL8213_XTALI: C?#66.1 U?#5.30(XTALI) X?#2.1(OSC1)
RTL_P3MDIA_N: C?#58.1 U?#5.37(P3MDIAN)
RTL_P3MDIA_P: C?#56.1 U?#5.36(P3MDIAP)
RTL_P3MDIB_N: C?#65.1 U?#5.39(P3MDIBN)
RTL_P3MDIB_P: C?#60.1 U?#5.38(P3MDIBP)
RX_N: C?#57.2 R?#33.1 U?#4.22(RXN)
RX_P: C?#55.2 R?#32.1 U?#4.23(RXP)
RXD0: R?#30.2 ; harness RMII.RXD0
RXD1: R?#31.2 ; harness RMII.RXD1
SFP1_RX_N: C?#32.1 J?#2.12(RD-)
SFP1_RX_P: C?#33.1 J?#2.13(RD+)
SFP1_TX_N: C?#47.2 J?#2.19(TD-)
SFP1_TX_P: C?#46.2 J?#2.18(TD+)
SFP_LOS: J?#2.8(RX_LOS) R?#25.2 ; port SFP_LOS
SFP_MOD_ABS: J?#2.6(MOD_ABS/MOD_DEF0) R?#24.2 ; port SFP_MOD_ABS
SFP_RATE_SEL: R?#26.2 R?#27.1
SFP_SCL: J?#2.5(SCL/MOD_DEF1) R?#42.1
SFP_SDA: J?#2.4(SDA/MOD_DEF2) R?#41.1
SFP_TX_DISABLE: J?#2.3(TX_DISABLE) R?#28.2
SFP_TX_FAULT: J?#2.2(TX_FAULT) R?#23.2
T_RTL82_CT1: R?#64.1 T?#1.1(MCT) T?#1.2(MCT)
T_RTL82_CT2: R?#65.1 T?#2.1(MCT) T?#2.2(MCT)
TX_N: C?#64.2 R?#35.1 U?#4.20(TXN)
TX_P: C?#59.2 R?#34.1 U?#4.21(TXP)
TXD0: U?#4.17(TXD0) ; harness RMII.TXD0
TXD1: U?#4.18(TXD1) ; harness RMII.TXD1
TXEN: U?#4.16(TXEN) ; harness RMII.TX_EN
NetC?#23_2: C?#23.2 C?#24.2 FB?.1 U?#4.1(VDD2A) U?#4.19(VDD1A)
NetC?#31_2: C?#31.2 R?#36.1 U?#4.15(NRST)
NetC?#35_2: C?#35.2 C?#36.2 C?#37.2 C?#38.2 C?#39.2 R?#53.1 U?#5.7(AVDDH) U?#5.14(AVDDH) U?#5.28(AVDDH) U?#5.35(AVDDH)
NetC?#48_2: C?#48.2 C?#49.2 C?#50.2 C?#51.2 C?#52.2 C?#53.2 C?#54.2 R?#60.1 U?#5.6(AVDDL) U?#5.8(DVDDL) U?#5.11(SVDDL) U?#5.22(DVDDL) U?#5.34(PLLVDDL) U?#5.40(AVDDL)
NetC?#56_2: C?#56.2 T?#1.4(MX+)
NetC?#58_2: C?#58.2 T?#1.3(MX-)
NetC?#60_2: C?#60.2 T?#2.4(MX+)
NetC?#65_2: C?#65.2 T?#2.3(MX-)
NetD?#1_A: D?#1.A U?#4.3(LED1/*REGOFF)
NetD?#1_K: D?#1.K R?#38.2
NetD?#2_K: D?#2.K R?#39.1
NetL?#3_1: L?#3.1 U?#5.17(LX) U?#5.18(LX)
NetR?#16_2: R?#41.2 ; port ESP32_I2C.SDA
NetR?#17_2: R?#42.2 ; port ESP32_I2C.SCL
NetR?#22_1: R?#22.1 U?#4.12(MDIO)
NetR?#39_2: R?#39.2 U?#4.2(LED2/*NINTSEL)
NetR?#43_2: R?#43.2 U?#4.24(RBIAS)
NetR?#64_2: R?#64.2 R?#65.2 R?#67.1
NetR?#66_1: R?#66.1 U?#5.29(XTALO)
NetR?#70_2: R?#70.2 U?#5.5(MDIREF)

Not connected (* = marked no-connect by the designer): J?#2 7(RATE_SEL); U?#4 4(XTAL2)* 14(NINT/REFCLKO)*; U?#5 1(P3MDICP)* 2(P3MDICN)* 3(P3MDIDP)* 4(P3MDIDN)*

### Layout directives
differential pair; differential pair class DIFF_100: 100BE_R_N, 100BE_R_P, 100BE_T_N, 100BE_T_P, RTL8213_SGMII_RX_N, RTL8213_SGMII_RX_P, RTL8213_SGMII_TX_N, RTL8213_SGMII_TX_P, RTL_P3MDIA_N, RTL_P3MDIA_P, RTL_P3MDIB_N, RTL_P3MDIB_P, RX_N, RX_P, SFP1_RX_N, SFP1_RX_P, SFP1_TX_N, SFP1_TX_P, TX_N, TX_P
net class RTL_SGMII: RTL8213_SGMII_RX_N, RTL8213_SGMII_RX_P, RTL8213_SGMII_TX_N, RTL8213_SGMII_TX_P
net class MDI-MT_RTL: 100BE_R_N, 100BE_R_P, 100BE_T_N, 100BE_T_P, RX_N, RX_P, TX_N, TX_P
net class MDI-RTL: RTL_P3MDIA_N, RTL_P3MDIA_P, RTL_P3MDIB_N, RTL_P3MDIB_P
net class SFP1_SGMII: RTL8213_SGMII_RX_N, RTL8213_SGMII_RX_P, SFP1_RX_N, SFP1_RX_P, SFP1_TX_N, SFP1_TX_P

### Notes on the sheet
- MODE 2:1, 0|0|0  10Base-T Half Duplex. Auto-negotiation disabled.
  MODE 2:1, 0|0|1  10Base-T Full Duplex. Auto-negotiation disabled.
  MODE 2:1, 0|1|0  100Base-TX Half Duplex. Auto-negotiation disabled. CRS is active during Transmit & Receive
  MODE 2:1, 0|1|1  100Base-TX Full Duplex. Auto-negotiation disabled. CRS is active during Receive.
  MODE 2:1, 1|0|0  100Base-TX Half Duplex is advertised. Autonegotiation enabled. CRS is active during Transmit & Receive
  MODE 2:1, 1|0|1  Repeater mode. Auto-negotiation enabled. 100Base-TX Half Duplex is advertised. CRS is active during Receive
  MODE 2:1, 1|1|0  Power Down mode.
  MODE 2:1, 1|1|1  All capable. Auto-negotiation enabled.
- The PHYAD0 bit is driven high or low to give each PHY a unique address.
  The device’s SMI address may be configured using hardware configuration to either the value 0 or 1.
- LED1/REGOFF internal PD.
  REGOFF Bit = 0
  LED Output Signal from LAN8720 is Active High
  Internal +1.2V Core Regulator is Enabled (Default)
  LED2/nINTSEL internal PU.
  nINTSEL Bit = 1
  LED Output Signal from LAN8720 is Active Low
  Interrupt Functionality Selected for Pin 14
- Harness for ESP
- DISAUTOLOAD/GPO45/P6LED1 =
  -Pull Up: Disable EEPROM autoload
  -Pull Down: Enable EEPROM autoload
  MID29/GPO48/P6LED0 =
  -Pull Up: Slave SMI (MDC/MDIO) Device Address is d’29 0x1D
  -Pull Down: Slave SMI (MDC/MDIO) Device Address is 0
  EN_PHY/GPO50/P3LED2 =
  -Pull Up: Enable embedded PHY
  -Pull Down: Disable embedded PHY
  SMI_SEL/GPO52/P3LED0=
  -Pull Up: Slave I2C-like interface
  -Pull Down: Slave MII Management interface
- Title:
- Date:
- Project:
- File:
- Size:
- A2
- Drawn by:
- Revision:
- www.somosinternet.com <http://www.somosinternet.com>
- (in symbol SFP20 47030-00J191) BOT; TOP

### Library data of the parts
C?#21-C?#28 C?#31 C?#34 C?#40-C?#42 C?#48 C?#50 C?#52 C?#54 C?#61-C?#63 C?#66 C?#67 = CAP-generic: as C?#1 on sheet 000_MCU - ESP32; Manuf1: *; Manuf2: *; Manuf1Partnumber: *; Manuf2Partnumber: *; ClassName: *; ROHS: Yes; LifeCycle: Checked; HelpURL: *
  C?#21 C?#23 C?#24 C?#31 C?#34 C?#48 C?#50 C?#52 C?#54 C?#61: Value: 0.1uF; Supplier 1: Digikey; Supplier Part Number 1: 311-3342-1-ND
  C?#22 C?#25 C?#40-C?#42: Value: 10uF; Supplier 1: DigiKey; Supplier Part Number 1: 490-GRM155R61A106ME11DCT-ND
  C?#26 C?#27: Value: 0.1uF; LCSC: C2888326; ComponentLink1Description: LCSC Link; ComponentLink1URL: https://www.lcsc.com/product-detail/C2888326.html?s_z=n_q_t_0.1uF%25200402&spm=wm.fly.bg.1.xh___wm.ssy.tc.0.tz&lcsc_vid=EgJfAwZfQFAKX11URFdeUQJWEVdaBVZUTgRWV10EQ1MxVlNeRFBaUFRXTlVaVDsOAxUeFF5JWBYZEEoKFBINSQcJGk4NBhADEA4cHktXRlVcSQwSGg0%3D
  C?#28: Value: 10uF; LCSC: C7472949; ComponentLink1Description: LCSC Link; ComponentLink1URL: https://www.lcsc.com/product-detail/C7472949.html?s_z=n_q_t_10uF%25200402&spm=wm.fly.bg.2.xh___wm.ssy.tc.0.tz&lcsc_vid=EgJfAwZfQFAKX11URFdeUQJWEVdaBVZUTgRWV10EQ1MxVlNeRFBaUVxWRFBfUTsOAxUeFF5JWBYZEEoKFBINSQcJGk4eFQsCAgIaSgADAwAHC0slQFVZVV1ST08GEwkK
  C?#62 C?#63: Value: 22uF; Supplier 1: Digikey; Supplier Part Number 1: 490-7611-1-ND
  C?#66 C?#67: Value: 18pF; Supplier 1: DigiKey; Supplier Part Number 1: 490-6117-1-ND
C?#29 = CAP-generic: Chip Ceramic Capacitor SMD; Manuf1: Samsung Electro-Mechanics; Manuf1Partnumber: CL05A474KA5NNNC; Populated: Yes; Value: 470pF; Manuf2: *; Manuf2Partnumber: *; ClassName: *; ROHS: Yes; LifeCycle: Checked; HelpURL: *; Supplier 1: LCSC; Supplier Part Number 1: C92361
C?#30 C?#35-C?#39 C?#43-C?#45 C?#49 C?#51 C?#53 = CAP-generic: Chip Ceramic Capacitor SMD; Manuf1: Samsung Electro-Mechanics; Manuf1Partnumber: CL05A105KO5NNNC; Populated: Yes; Value: 1uF; Manuf2: *; Manuf2Partnumber: *; ClassName: *; ROHS: Yes; LifeCycle: Checked; HelpURL: *; Supplier 1: LCSC; Supplier Part Number 1: C29266
C?#32 C?#33 = CAP-generic: Chip Ceramic Capacitor SMD; Populated: Yes; Voltage: 10V; Value: 0.1uF; Manuf1: *; Manuf2: *; Manuf1Partnumber: *; Manuf2Partnumber: *; ClassName: *; ROHS: Yes; LifeCycle: Checked; HelpURL: *; Code_JEDEC: X5R; Supplier 1: DigiKey; Supplier Part Number 1: 490-14571-1-ND
C?#46 C?#47 C?#55-C?#60 C?#64 C?#65 = CAP-generic: Chip Ceramic Capacitor SMD; Populated: Yes; Voltage: 16V; Temperature Coeficient: X7R; Value: 0.1uF; Manuf1: *; Manuf2: *; Manuf1Partnumber: *; Manuf2Partnumber: *; ClassName: *; ROHS: Yes; LifeCycle: Checked; HelpURL: *; Supplier 1: Digikey; Supplier Part Number 1: 311-3342-1-ND
D?#1 D?#2 = LED: LED GREEN WATER CLEAR 0603 SMD; Manufacturer: HONGLITRONIC; Manufacturer Part Number: PSC-1608U52GC-G4; Value: GRN; Supplier Part Number 1: C22371297; ComponentLink1Description: LCSC; ComponentLink1URL: https://www.lcsc.com/product-detail/C22371297.html?s_z=n_q_led%2520green%25200603
FB? = RES-generic: Chip Resistor SMD; Manuf1: TDK; Manuf1Partnumber: MPZ1608S601ATA00; Populated: Yes; Value: 600OHM; Supplier 1: LCSC; Supplier Part Number 1: C107335
J?#1 = U77A16182001: Connector Accessories SFP Cage Right Angle Copper Alloy Nickel Tray; Manufacturer: Amphenol Communications Solutions; Current Rating: 500mA; Gender: Female; Insulation Resistance: 1GΩ; Number of Ports: 1; Voltage Rating: 3.3V; Supplier: DigiKey; Supplier Part Number: 664-U77A16182001-ND; Manufacturer Part Number: U77A16182001; RoHS: Compliant; Category: Connectors; Stock: 11893; Pricing: 1=2,72, 10=2,307, 25=2,1624, 50=2,059, 100=1,9607, 250=1,83784, 500=1,7501, 1000=1,66661, 2500=1,56234 (USD); Connector Type: SFP; Contact Plating: Nickel; Depth: 48.98mm; Features: Shielded; Housing Material: Copper; Lead Free: Lead Free; Length: 16.3mm; Lifecycle Status: Production; Max Operating Temperature: 85°C; Min Operating Temperature: -40°C; Mounting Technology: Through Hole; Orientation: Right Angle; REACH SVHC: Unknown; Termination: Press-Fit; ComponentLink1URL: https://datasheet.octopart.com:443/U77A16182001-Amphenol-Communications-Solutions-datasheet-116638668.pdf?src-supplier=Electro+Sonic; ComponentLink1Description: https://datasheet.octopart.com:443/U77A16182001-Amphenol-Communications-Solutions-datasheet-116638668.pdf?src-supplier=Electro+Sonic; ComponentLink2URL: https://datasheet.octopart.com:443/U77A16182001-Amphenol-Communications-Solutions-datasheet-8501042.pdf?src-supplier=Farnell; ComponentLink2Description: https://datasheet.octopart.com:443/U77A16182001-Amphenol-Communications-Solutions-datasheet-8501042.pdf?src-supplier=Farnell; LCSC: C42931382
J?#2 = SFP20 47030-00J191: CONN SFP  RCPT 20POS SLD R/A SMD; Manufacturer: CND-Tek; LCSC: C50159076; Manufacturer Part Number: SFP20 47030-00J191; ComponentLink1Description: LCSC Link; ComponentLink1URL: https://www.lcsc.com/product-detail/C50159076.html?s_z=n_SFP
L?#2 L?#3 = IND-generic: Chip Inductor SMD; Populated: Yes; Manuf1: *; Manuf2: *; Manuf1Partnumber: *; Manuf2Partnumber: *; ClassName: *; ROHS: Yes; LifeCycle: Checked; HelpURL: *; Supplier 1: DigiKey
  L?#2: Value: 0R; Current: *; Supplier Part Number 1: RMCF0603ZT0R00CT-ND
  L?#3: Value: 2.2uH; Supplier Part Number 1: 445-172972-1-ND
R?#21 R?#23-R?#26 R?#28 R?#29 R?#41 R?#42 R?#58 R?#59 R?#66 = RES-generic: as R?#10 on sheet 000_MCU - ESP32; Manuf1: *; Manuf2: *; Manuf1Partnumber: *; Manuf2Partnumber: *; ClassName: *; ROHS: Yes; LifeCycle: Checked; HelpURL: *; Power: *
  R?#21 R?#29 R?#41 R?#42 R?#58 R?#59: Value: 0R; Supplier 1: DigiKey; Supplier Part Number 1: 311-0.0JRCT-ND
  R?#23-R?#26: Value: 5.1K; Supplier 1: DigiKey; Supplier Part Number 1: 311-5.10KLRCT-ND
  R?#28: Value: 1K; Supplier 1: Digikey; Supplier Part Number 1: P1.00KLDKR-ND
  R?#66: Value: 100R; Supplier 1: DigiKey; Supplier Part Number 1: 311-100LRCT-ND
R?#22 = RES-generic: Chip Resistor SMD; Manuf1: FOJAN; Manuf1Partnumber: FRC0603F1501TS; Populated: Yes; Value: 1.5k; Manuf2: *; Manuf2Partnumber: *; ClassName: *; ROHS: Yes; LifeCycle: Checked; HelpURL: *; Power: *; Tolerance: *; Supplier 1: LCSC; Supplier Part Number 1: C2930050
R?#27 R?#45 R?#50-R?#52 R?#54 R?#55 R?#69 = DNP-RES: as R?#1 on sheet 000_MCU - ESP32; Manuf1: *; Manuf2: *; Manuf1Partnumber: *; Manuf2Partnumber: *; ClassName: *; ROHS: Yes; LifeCycle: Checked; HelpURL: *; Power: *; Tolerance: *
  R?#27: Value: 5.1K
  R?#45 R?#50-R?#52: Value: NC/10k
  R?#54 R?#55 R?#69: Value: NC/5.1k
R?#30 R?#31 R?#37 = RES-generic: Chip Resistor SMD; Manuf1: FOJAN; Manuf1Partnumber: FRC0402J100 TS; Populated: Yes; Value: 10R; Manuf2: *; Manuf2Partnumber: *; ClassName: *; ROHS: Yes; LifeCycle: Checked; HelpURL: *; Power: *; Supplier 1: LCSC; Supplier Part Number 1: C2906886
R?#32-R?#35 = RES-generic: Chip Resistor SMD; Manuf1: FOJAN; Manuf1Partnumber: FRC0603F49R9TS; Populated: Yes; Value: 49.9R; Manuf2: *; Manuf2Partnumber: *; ClassName: *; ROHS: Yes; LifeCycle: Checked; HelpURL: *; Power: *; Tolerance: *; Supplier 1: LCSC; Supplier Part Number 1: C2930110
R?#36 R?#46-R?#49 R?#53 R?#56 R?#57 R?#60-R?#65 R?#67 R?#68 R?#70 = RES-generic: Chip Resistor SMD; Populated: Yes; Manuf1: *; Manuf2: *; Manuf1Partnumber: *; Manuf2Partnumber: *; ClassName: *; ROHS: Yes; LifeCycle: Checked; HelpURL: *; Power: *
  R?#36 R?#46-R?#49: Value: 10k; Supplier 1: Digikey; Supplier Part Number 1: 1276-3431-1-ND
  R?#53 R?#60: Value: 0R; Tolerance: *; Supplier 1: Digi-Key; Supplier Part Number 1: RMCF0603ZT0R00CT-ND
  R?#56 R?#57 R?#61-R?#63 R?#68: Value: 5.1K; Supplier 1: DigiKey; Supplier Part Number 1: 311-5.10KLRCT-ND
  R?#64 R?#65: Value: 75R; Tolerance: *; Supplier 1: DigiKey; Supplier Part Number 1: YAG1306CT-ND
  R?#67: Value: 1000pF; Tolerance: *; Supplier 1: DigiKey; Supplier Part Number 1: 399-C0603C102MBRACTUCT-ND
  R?#70: Value: 2.49K; Supplier 1: DigiKey; Supplier Part Number 1: YAG3468CT-ND
R?#38 R?#39 = RES-generic: Chip Resistor SMD; Manuf1: FOJAN; Manuf1Partnumber: FRC0402F2700TS; Populated: Yes; Value: 27R; Manuf2: *; Manuf2Partnumber: *; ClassName: *; ROHS: Yes; LifeCycle: Checked; HelpURL: *; Power: *; Supplier 1: LCSC; Supplier Part Number 1: C2909342
R?#40 R?#44 = RES-generic: Chip Resistor SMD; Manuf1: FOJAN; Manuf1Partnumber: FRC0402J330 TS; Populated: Yes; Value: 33R; Manuf2: *; Manuf2Partnumber: *; ClassName: *; ROHS: Yes; LifeCycle: Checked; HelpURL: *; Power: *; Supplier 1: LCSC; Supplier Part Number 1: C2906931
R?#43 = RES-generic: Chip Resistor SMD; Manuf1: FOJAN; Manuf1Partnumber: FRC0603F1212TS; Populated: Yes; Value: 12.1k; Manuf2: *; Manuf2Partnumber: *; ClassName: *; ROHS: Yes; LifeCycle: Checked; HelpURL: *; Power: *; Tolerance: *; Supplier 1: LCSC; Supplier Part Number 1: C2930059
T?#1 T?#2 = CM3216D25-501: CHIP LAN FILTER, Meets IEEE 802.3 & ANSI X3.263 Standards, Designed For 2.5G BASE - T Applications, Surface Mount Type
TP? = TestPoint: Test Point
U?#4 = LAN8720A-CP-TR: Small Footprint RMII 10/100 Ethernet Transceiver with HP Auto-MDiX Support; Manufacturer: Microchip; Supplier 1: LCSC; Manufacturer PartNumber: LAN8720A-CP-TR; Supplier Part Number 1: C45223; ComponentLink1Description: LCSC; ComponentLink1URL: https://www.lcsc.com/product-detail/C45223.html?s_z=n_q_lan8720
U?#5 = RTL8213B-CG: 10/100/1000M Copper to 100Base-FX/1000Base-X Fiber Media Converter; Manufacturer: Realtek; Manufacturer Part Numebr: RTL8213B-CG; LCSC: C2766076; ComponentLink1Description: LCSC Link; ComponentLink1URL: https://www.lcsc.com/product-detail/C2766076.html
X?#2 = XTAL-4: Generic Crystal 4SMD; Populated: Yes; ROHS: Yes; Value: 25Mhz; Supplier 1: DigiKey; Supplier Part Number 1: 2151-RH100-25.000-16-F-3030-EXT-TRCT-ND
Y? = SX2M50.000M20F30TNN: XTAL OSC 50MHz CMOS SMD; Manufacturer: SCTF; Manufacturer Part Number: SX2M50.000M20F30TNN; Supplier Part Number 1: C2901606; Supplier 1: LCSC; ComponentLink1Description: LCSC; ComponentLink1URL: https://www.lcsc.com/product-detail/C2901606.html?s_z=s_c_Oscillators

## Sheet 300_Control.SchDoc: Control
size A3; Date: 202610xx; DrawnBy: J-E.Pachon-J.Jaramillo; Revision: V1R1; SheetNumber: 5; SheetTotal: 7
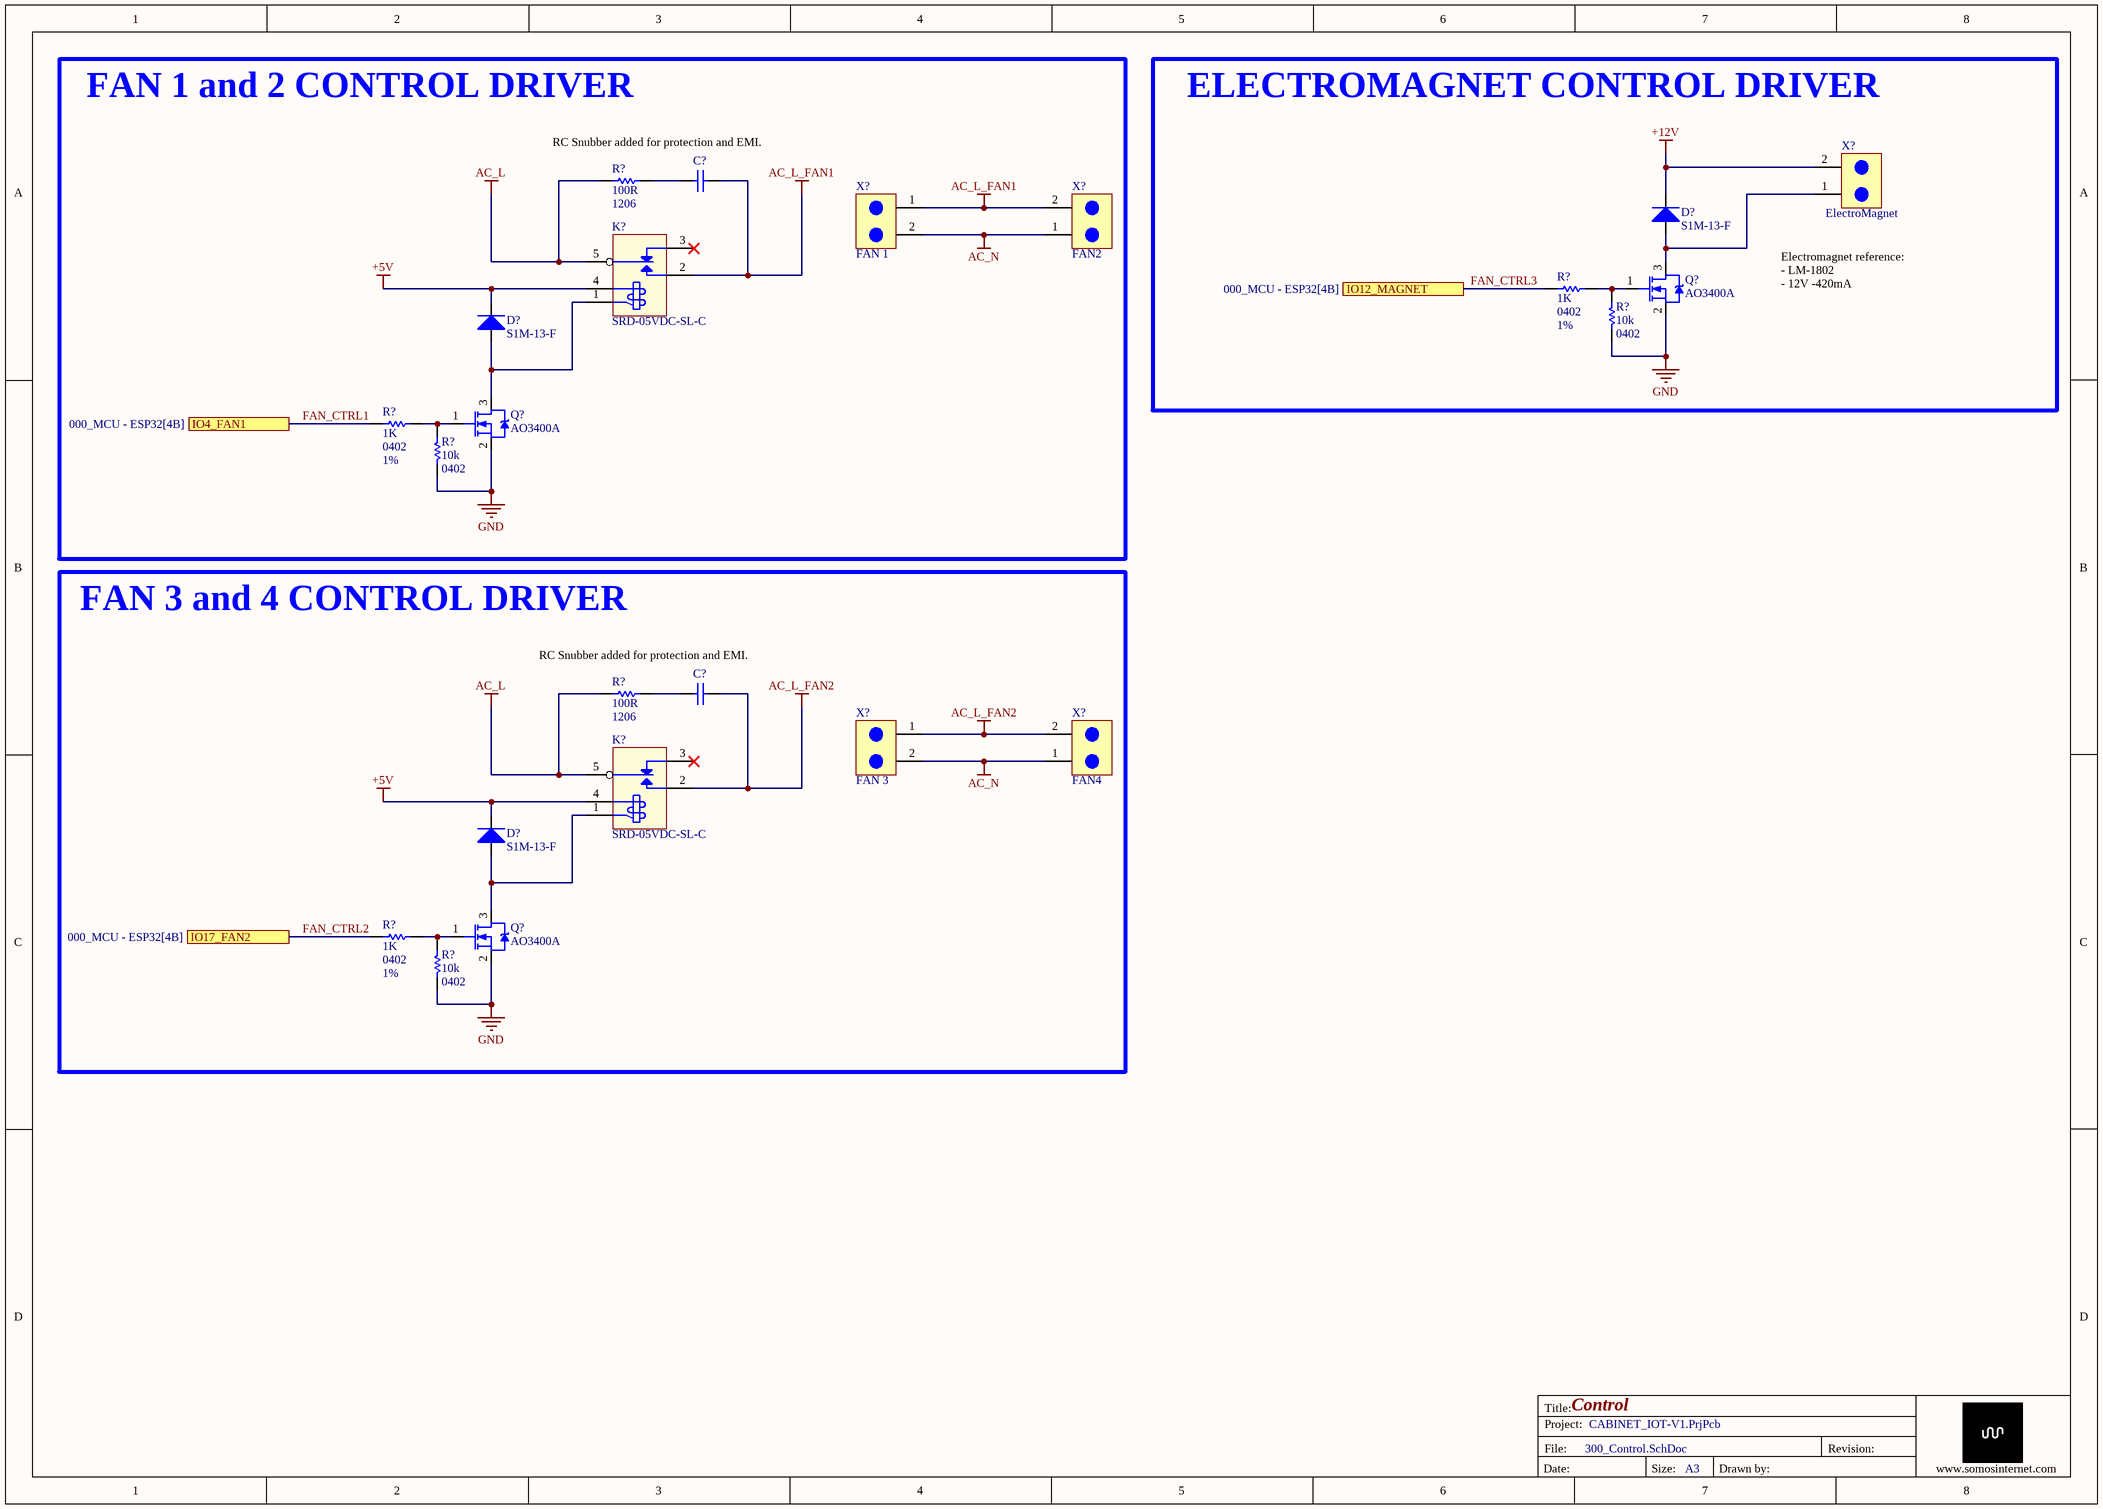
[diagram p4: 300_Control.SchDoc]

### Parts
(Parts that share a designator on the sheet are numbered #1, #2 ... from top to bottom, then left to right.)
C?#68  MPX104K31C3KN15600  [Safety Capacitor TH,P=10mm]  (value not drawn)
C?#69  MPX104K31C3KN15600  [Safety Capacitor TH,P=10mm]  (value not drawn)
D?#3  S1M-13-F  [DO214AC]
D?#4  S1M-13-F  [DO214AC]
D?#5  S1M-13-F  [DO214AC]
K?#1  SRD-05VDC-SL-C  [Relay_1C TH_19.2x15.6mm]
K?#2  SRD-05VDC-SL-C  [Relay_1C TH_19.2x15.6mm]
Q?#1  AO3400A  [SOT23_N]
Q?#2  AO3400A  [SOT23_N]
Q?#3  AO3400A  [SOT23_N]
R?#71  100R  PackageReference: 1206  [RESC3216X06N[1206]]
R?#72  1K  PackageReference: 0402  Tolerance: 1%  [RESC1005X03N[0402]]
R?#73  10k  PackageReference: 0402  [RESC1005X03N[0402]]
R?#74  1K  PackageReference: 0402  Tolerance: 1%  [RESC1005X03N[0402]]
R?#75  10k  PackageReference: 0402  [RESC1005X03N[0402]]
R?#76  100R  PackageReference: 1206  [RESC3216X06N[1206]]
R?#77  1K  PackageReference: 0402  Tolerance: 1%  [RESC1005X03N[0402]]
R?#78  10k  PackageReference: 0402  [RESC1005X03N[0402]]
X?#3  FAN 1  [TH,Right Angle,P=5mm]
X?#4  ElectroMagnet  [TH,Right Angle,P=5mm]
X?#5  FAN2  [TH,Right Angle,P=5mm]
X?#6  FAN 3  [TH,Right Angle,P=5mm]
X?#7  FAN4  [TH,Right Angle,P=5mm]

### Blocks framed on the sheet
FAN 1 and 2 CONTROL DRIVER: C?#68 D?#4 K?#1 Q?#2 R?#71 R?#74 R?#75 X?#3 X?#5
ELECTROMAGNET CONTROL DRIVER: D?#3 Q?#1 R?#72 R?#73 X?#4
FAN 3 and 4 CONTROL DRIVER: C?#69 D?#5 K?#2 Q?#3 R?#76-R?#78 X?#6 X?#7

### Ports
IO4_FAN1 (see 000_MCU - ESP32[4B]), IO12_MAGNET (see 000_MCU - ESP32[4B]), IO17_FAN2 (see 000_MCU - ESP32[4B])

### Nets
+5V: D?#4.K D?#5.K K?#1.4 K?#2.4
+12V: D?#3.K Q?#1.2(S) Q?#2.2(S) Q?#3.2(S) R?#73.2 R?#75.2 R?#78.2 X?#4.2  [also labelled GND]
AC_L: K?#1.5 K?#2.5 R?#71.1 R?#76.1
AC_L_FAN1: C?#68.2 K?#1.2 X?#3.1 X?#5.2
AC_L_FAN2: C?#69.2 K?#2.2 X?#6.1 X?#7.2
AC_N: X?#3.2 X?#5.1 X?#6.2 X?#7.1
FAN_CTRL1: R?#74.2 ; port IO4_FAN1
FAN_CTRL2: R?#77.2 ; port IO17_FAN2
FAN_CTRL3: R?#72.2 ; port IO12_MAGNET
NetC?#68_1: C?#68.1 R?#71.2
NetC?#69_1: C?#69.1 R?#76.2
NetD?#3_A: D?#3.A Q?#1.3(D) X?#4.1
NetD?#4_A: D?#4.A K?#1.1 Q?#2.3(D)
NetD?#5_A: D?#5.A K?#2.1 Q?#3.3(D)
NetQ?#1_1: Q?#1.1(G) R?#72.1 R?#73.1
NetQ?#2_1: Q?#2.1(G) R?#74.1 R?#75.1
NetQ?#3_1: Q?#3.1(G) R?#77.1 R?#78.1

Not connected (* = marked no-connect by the designer): K?#1 3*; K?#2 3*

### Notes on the sheet
- RC Snubber added for protection and EMI.
- Electromagnet reference:
  - LM-1802
  - 12V -420mA
- Title:
- Project:
- File:
- Revision:
- Date:
- Size:
- A3
- Drawn by:
- www.somosinternet.com <http://www.somosinternet.com>

### Library data of the parts
C?#68 C?#69 = Safety Capacitor MPX104K31C3KN15600: CAP SAFETY 100nF ±10% 275V 305V 310V TH; Manufacturer: KNSCHA; Manufacturer Part Number: MPX104K31C3KN15600; Supplier 1: LCSC; Supplier Part Number 1: C489079; ComponentLink1Description: LCSC; ComponentLink1URL: https://www.lcsc.com/product-detail/C489079.html
D?#3-D?#5 = Diode: DIODES S1M-13-F; Supplier Part Number 1: C155378; Supplier 1: LCSC; Manufacturer: DIODES; Manufacturer PArt Number: S1M-13-F
K?#1 K?#2 = SRD-05VDC-SL-C: Songle Relay SRD-05VDC-SL-C; Manufacturer: Songle Relay; Manufacturer Part Number: SRD-05VDC-SL-C; Supplier Part Number 1: C35449; Supplier 1: LCSC; ComponentLink1Description: LCSC; ComponentLink1URL: https://www.lcsc.com/product-detail/C35449.html
Q?#1-Q?#3 = NMOS-3: N-Channel Power MOSFET; Manufacturer: AOS; Manufacturer Part Number: AO3400A; Supplier 1: LCSC; Supplier Part Number 1: C20917; ComponentLink1Description: LCSC; ComponentLink1URL: https://www.lcsc.com/product-detail/C20917.html?s_z=n_q_AO3400A
R?#71 R?#76 = RES-generic: RES 100Ω ±1% 500mW 1206; Manuf1: FOJAN; Manuf2: FRP1206F1000TS; Populated: Yes; Value: 100R; Manuf1Partnumber: *; Manuf2Partnumber: *; ClassName: *; ROHS: Yes; LifeCycle: Checked; HelpURL: *; Power: *; Tolerance: *; Supplier 1: LCSC; Supplier Part Number 1: C5713416
R?#72 R?#74 R?#77 = RES-generic: Chip Resistor SMD; Populated: Yes; Value: 1K; Manuf1: *; Manuf2: *; Manuf1Partnumber: *; Manuf2Partnumber: *; ClassName: *; ROHS: Yes; LifeCycle: Checked; HelpURL: *; Power: *; Supplier 1: Digikey; Supplier Part Number 1: P1.00KLDKR-ND
R?#73 R?#75 R?#78 = RES-generic: as R?#10 on sheet 000_MCU - ESP32; Value: 10k; Manuf1: *; Manuf2: *; Manuf1Partnumber: *; Manuf2Partnumber: *; ClassName: *; ROHS: Yes; LifeCycle: Checked; HelpURL: *; Power: *; Supplier 1: Digikey; Supplier Part Number 1: 1276-3431-1-ND
X?#3-X?#7 = TERMINAL BLOCK 2PIN 5mm: as X?#1 on sheet 100_Power Supply; Supplier: LCSC; Supplier Part Number 1: C441225; ComponentLink1Description: LCSC; ComponentLink1URL: https://www.lcsc.com/product-detail/C441225.html

## Sheet 400_Sensors.SchDoc: Sensors
size A3; Date: 202610xx; DrawnBy: J-E.Pachon-J.Jaramillo; Revision: V1R1; SheetNumber: 6; SheetTotal: 7
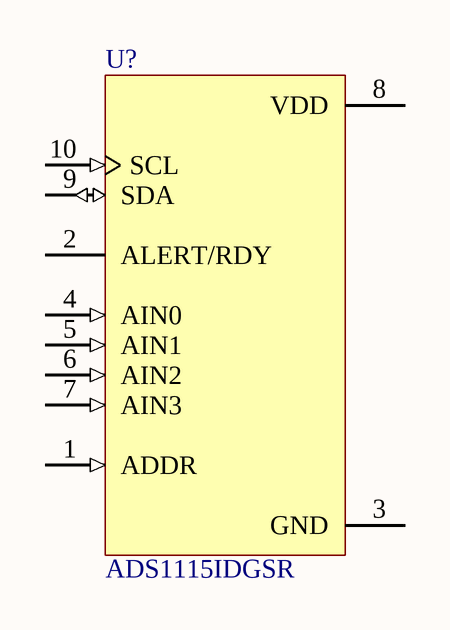
[diagram p5: 400_Sensors.SchDoc]

### Parts
(Parts that share a designator on the sheet are numbered #1, #2 ... from top to bottom, then left to right.)
U?#6  ADS1115IDGSR  [TI-DGS10_N]

### Nets

Not connected (* = marked no-connect by the designer): U?#6 1(ADDR) 2(ALERT/RDY) 3(GND) 4(AIN0) 5(AIN1) 6(AIN2) 7(AIN3) 8(VDD) 9(SDA) 10(SCL)

### Notes on the sheet
- Title:
- Project:
- File:
- Revision:
- Date:
- Size:
- A3
- Drawn by:
- www.somosinternet.com <http://www.somosinternet.com>

### Library data of the parts
U?#6 = ADS1115IDGSR: 16-Bit ADC with Integrated Multiplexer, PGA, Comparator, Oscillator, and Reference, -40 to 125 degC, 10-pin SOP (DGS10), Green (RoHS & no Sb/Br); Manufacturer: Texas Instruments; # Input Channels: 4; Analog Voltage AV/DD(Max)(V): 5.5; Analog Voltage AV/DD(Min)(V): 2; Architecture: Delta-Sigma; INL(Max)(+/-LSB): 1; Interface: Serial I2C; Resolution(Bits): 16; Sample Rate (max)(SPS): 860; SubFamily: Precision ADC (<=10MSPS); DatasheetVersion: SBAS444B; PackageVersion: 4073272/C, 02/2004; PackageReference: DGS10; PackageDescription: 10-Pin Plastic Small Outline, Body 3 x 3 mm, Pitch 0.5 mm; Supplier 1: Digi-Key; Supplier Part Number 1: 296-13060-2-ND; Digital Supply(Max)(V): 5.5; Digital Supply(Min)(V): 2; Eco-Plan: Green (RoHS & no Sb/Br); Mounting Technology: Surface Mount; Code_JEDEC: MO-153; PartNumber: ADS1115IDGSR; ComponentLink1Description: Manufacturer URL; ComponentLink1URL: http://www.ti.com/; ComponentLink2Description: Datasheet; ComponentLink2URL: http://www.ti.com/general/docs/lit/getliterature.tsp?genericPartNumber=ADS1115&fileType=pdf; ComponentLink3Description: Package Specification; ComponentLink3URL: http://www.ti.com/lit/ml/mpds035b/mpds035b.pdf

## Sheet 500_External.SchDoc: External
size A3; Date: 202610xx; DrawnBy: J-E.Pachon-J.Jaramillo; Revision: V1R1; SheetNumber: 7; SheetTotal: 6

### Notes on the sheet
- Title:
- Project:
- File:
- Revision:
- Date:
- Size:
- A3
- Drawn by:
- www.somosinternet.com <http://www.somosinternet.com>